# Altium project AINGF_V2.PrjPcb (part 1 of 2)
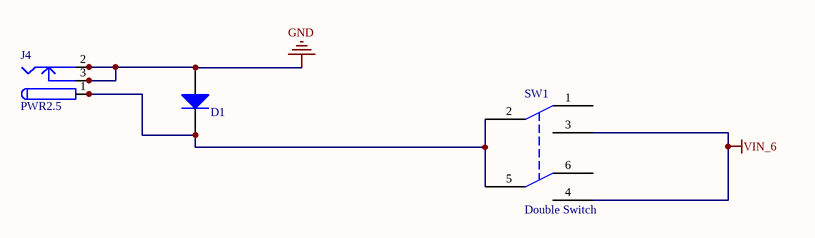
[diagram p0: PWR1.SchDoc]
15 sheets, 230 parts. Net scope: global (net labels, ports and power ports of the same name join across sheets).
Board file: PCB_T1.PcbDoc
Sheets:
  PWR1.SchDoc
  PWR2.SchDoc
  FPGA1.SchDoc
  FPGA2.SchDoc
  FPGA3.SchDoc
  FPGA4.SchDoc
  FPGA5.SchDoc
  FPGA6.SchDoc
  SRAM.SchDoc
  SRAM1.SchDoc
  USBFX2LP_1.SchDoc
  USBFX2LP_2.SchDoc
  USBFX2LP_3.SchDoc
  USBFX2LP_4.SchDoc
  FT2232D.SchDoc

## Sheet PWR1.SchDoc: Power1
size A; Revision: 04

### Parts
D1  SMD 4007 DIODE  [PCBComponent_1]  (value not drawn)
J4  PWR2.5  [KLD-0202]
SW1  Double Switch  [Switch - DPDT]

### Nets
GND: D1.1(A) J4.2 J4.2A J4.2B J4.3 J4.3A J4.3B
VIN_6: SW1.3 SW1.4
NetD1_2: D1.2(K) J4.1 J4.1A J4.1B SW1.2 SW1.5

Not connected (* = marked no-connect by the designer): SW1 1 6

### Notes on the sheet
- Engineer:
- Title:
- Saleh Jamali
- Revision:

### Library data of the parts
J4 = PWR2.5: Low Voltage Power Supply Connector; Published: 17-Dec-2003; DatasheetDocument: 09-May-2002; Publisher: Altium Limited; ComponentLink1Description: Manufacturer Link; ComponentLink1URL: http://domino.kycon.com/internet/Products.html
SW1 = Switch - DPDT: DPDT Switch

## Sheet PWR2.SchDoc: Power2
size A; Revision: 04
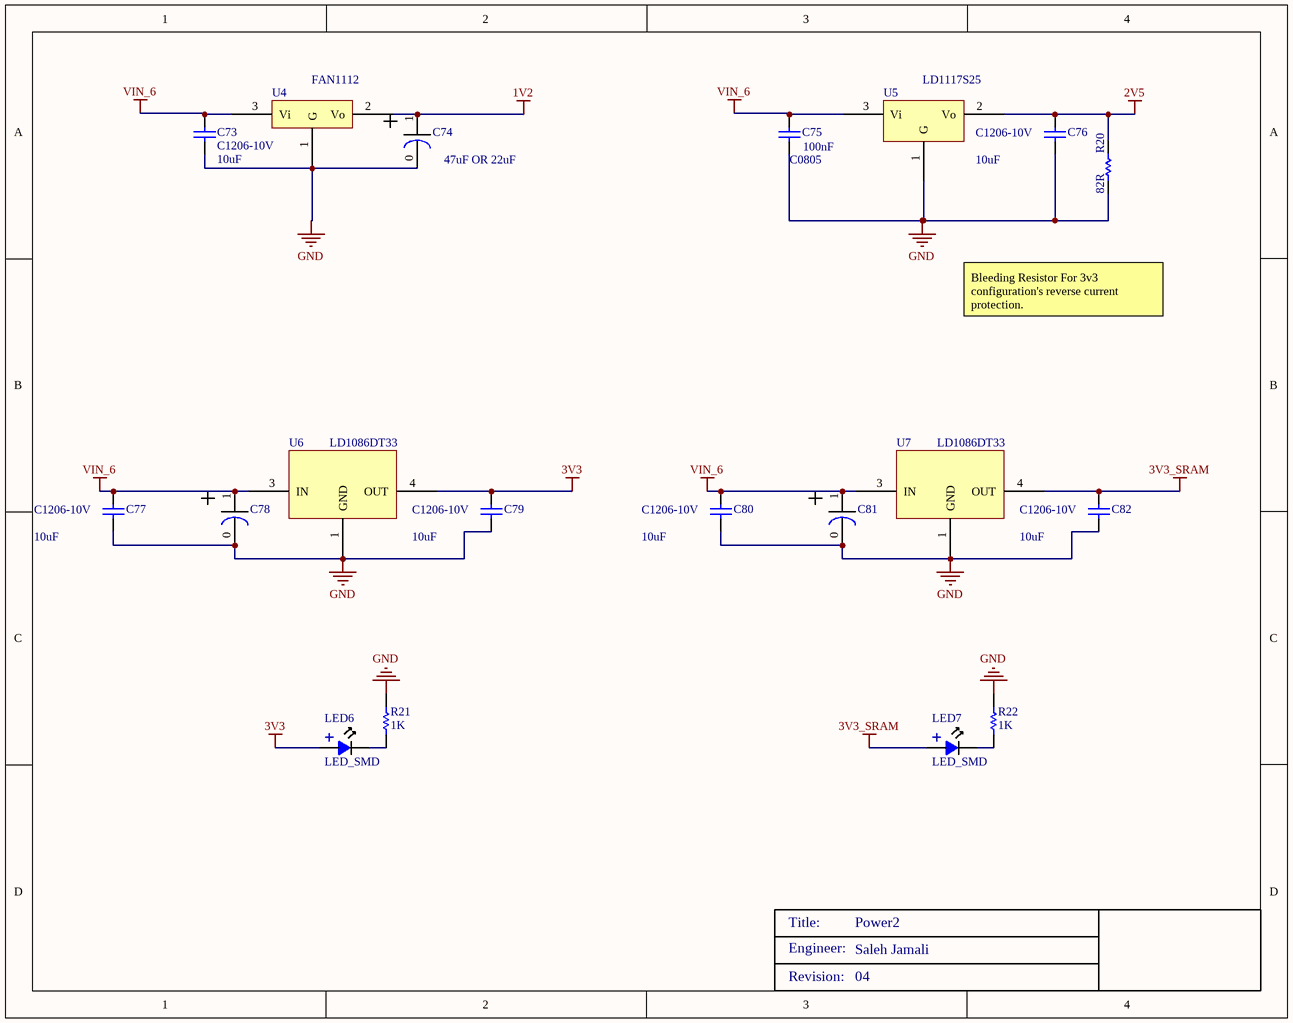
[diagram p1: PWR2.SchDoc]

### Parts
C73  C1206-10V  value 10uF  [1206]
C74  47uF OR 22uF  [22_47u_10A]
C75  C0805  value 100nF  [0805]
C76  C1206-10V  value 10uF  [1206]
C77  C1206-10V  value 10uF  [1206]
C78  Electrolytic SMD Cap  [22_47u_10A]  (value not drawn)
C79  C1206-10V  value 10uF  [1206]
C80  C1206-10V  value 10uF  [1206]
C81  Electrolytic SMD Cap  [22_47u_10A]  (value not drawn)
C82  C1206-10V  value 10uF  [1206]
LED6  LED_SMD  [LED_805]
LED7  LED_SMD  [LED_805]
R20  82R  [ERA-0805]
R21  1K  [ERA-0805]
R22  1K  [ERA-0805]
U4  FAN1112  [DPAK_TO252]
U5  LD1117S25  [SOT223]
U6  LD1086DT33  [LD1086DT33]
U7  LD1086DT33  [LD1086DT33]

### Nets
1V2: C74.1 U4.2(Vo)
2V5: C76.1 R20.2 U5.2(Vo)
3V3: C79.1 LED6.1 U6.4(OUT)
3V3_SRAM: C82.1 LED7.1 U7.4(OUT)
GND: C73.2 C74.0 C75.2 C76.2 C77.2 C78.0 C79.2 C80.2 C81.0 C82.2 R20.1 R21.1 R22.1 U4.1(G) U5.1(G) U6.1(GND) U7.1(GND)
VIN_6: C73.1 C75.1 C77.1 C78.1 C80.1 C81.1 U4.3(Vi) U5.3(Vi) U6.3(IN) U7.3(IN)
NetLED6_2: LED6.2 R21.2
NetLED7_2: LED7.2 R22.2

### Notes on the sheet
- Bleeding Resistor For 3v3 configuration's reverse current protection.
- Engineer:
- Title:
- Saleh Jamali
- Revision:

### Library data of the parts
C73 C76 C77 C79 C80 C82 = C1206: Ceramic Chip Capacitor - Standard; Published: 17-Jul-2002; LatestRevisionDate: 19-Mar-2004; LatestRevisionNote: Silkscreen size reduced.; DatasheetDocument: Mar-2001; PackageDocument: Mar-2001; PackageReference: 1206; Publisher: Altium Limited; Code_JEITA: 1206; Code_IPC: 3216 [1206]; ComponentLink1Description: Manufacturer Link; ComponentLink1URL: http://www.kemet.com/; ComponentLink2Description: Datasheet; ComponentLink2URL: http://www.kemet.com/kemet/web/homepage/kechome.nsf/vapubfilesname/F3102TA.pdf/$file/F3102TA.pdf
C74 = Electrolytic SMD Cap: supplier: eshop.eca.ir
C75 = C0805: Ceramic Chip Capacitor - Standard; Note: Footprint corresponds to dimensions for bulk cassette packaging. This case size has tightened tolerances.; Published: 17-Jul-2002; LatestRevisionDate: 19-Mar-2004; LatestRevisionNote: Silkscreen size reduced.; DatasheetDocument: Mar-2001; PackageDocument: Mar-2001; PackageReference: 0805; Publisher: Altium Limited; Code_JEITA: 0805; Code_IPC: 2012[0805]; ComponentLink1Description: Manufacturer Link; ComponentLink1URL: http://www.kemet.com/; ComponentLink2Description: Datasheet; ComponentLink2URL: http://www.kemet.com/kemet/web/homepage/kechome.nsf/vapubfilesname/F3102TA.pdf/$file/F3102TA.pdf
R20-R22 = ERA6Y: Rectangular Thick Film Chip Resistor, 10 Ohm to 1M Ohm Range, 0.1% and 0.5% Tolerance, 0805 Size, 0.1 W; Note: If flow soldering, adjust pad width of PCB Footprint to 0.7 - 0.8 times the width of the resistor.; Published: 17-Dec-2003; LatestRevisionDate: 19-Mar-2004; LatestRevisionNote: Silkscreen size reduced.; PackageDocument: Mar-2003; PackageReference: ERA-0805; Publisher: Altium Limited; Code_IPC: 2012 [0805]; ComponentLink1Description: Manufacturer Link; ComponentLink1URL: http://www.panasonic.com/industrial/components/resistive_products.htm; ComponentLink2Description: Datasheet; ComponentLink2URL: http://www.panasonic.com/industrial/components/pdf/AOA0000CE8.pdf
U4 = FAN1112_1.2V_REGULATER: 1.2 volt regulator
U5 = LD1117S25: 2.5 volt, 800mA Regulator
U6 U7 = LD1086DT33: LOW DROP FIXED AND ADJUSTABLE  POSITIVE VOLTAGE REGULATORS
C78 C81 = Electrolytic SMD Cap: supplier: eshop.eca.ir

## Sheet FPGA1.SchDoc: FPGA1
size A; Revision: 04
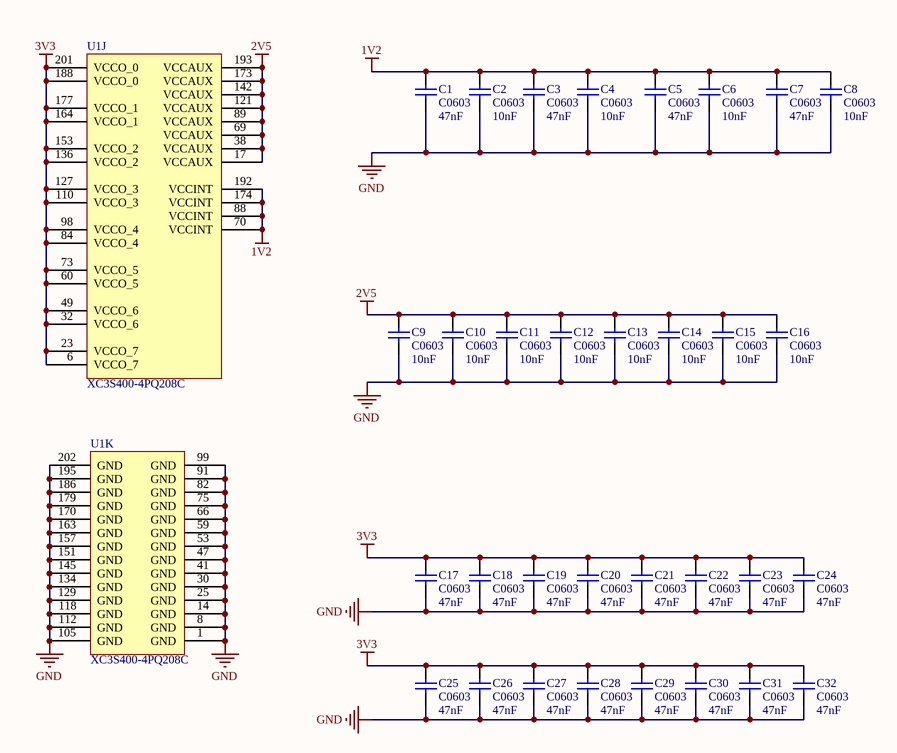
[diagram p2: FPGA1.SchDoc]

### Parts
C1  C0603  value 47nF  [0603]
C2  C0603  value 10nF  [0603]
C3  C0603  value 47nF  [0603]
C4  C0603  value 10nF  [0603]
C5  C0603  value 47nF  [0603]
C6  C0603  value 10nF  [0603]
C7  C0603  value 47nF  [0603]
C8  C0603  value 10nF  [0603]
C9  C0603  value 10nF  [0603]
C10  C0603  value 10nF  [0603]
C11  C0603  value 10nF  [0603]
C12  C0603  value 10nF  [0603]
C13  C0603  value 10nF  [0603]
C14  C0603  value 10nF  [0603]
C15  C0603  value 10nF  [0603]
C16  C0603  value 10nF  [0603]
C17  C0603  value 47nF  [0603]
C18  C0603  value 47nF  [0603]
C19  C0603  value 47nF  [0603]
C20  C0603  value 47nF  [0603]
C21  C0603  value 47nF  [0603]
C22  C0603  value 47nF  [0603]
C23  C0603  value 47nF  [0603]
C24  C0603  value 47nF  [0603]
C25  C0603  value 47nF  [0603]
C26  C0603  value 47nF  [0603]
C27  C0603  value 47nF  [0603]
C28  C0603  value 47nF  [0603]
C29  C0603  value 47nF  [0603]
C30  C0603  value 47nF  [0603]
C31  C0603  value 47nF  [0603]
C32  C0603  value 47nF  [0603]
U1  XC3S400-4PQ208C  [PQ208_N]  (parts J,K of 11)

### Nets
1V2: C1.2 C2.2 C3.2 C4.2 C5.2 C6.2 C7.2 C8.2 U1.70(VCCINT) U1.88(VCCINT) U1.174(VCCINT) U1.192(VCCINT)
2V5: C9.2 C10.2 C11.2 C12.2 C13.2 C14.2 C15.2 C16.2 U1.17(VCCAUX) U1.38(VCCAUX) U1.69(VCCAUX) U1.89(VCCAUX) U1.121(VCCAUX) U1.142(VCCAUX) U1.173(VCCAUX) U1.193(VCCAUX)
3V3: C17.2 C18.2 C19.2 C20.2 C21.2 C22.2 C23.2 C24.2 C25.2 C26.2 C27.2 C28.2 C29.2 C30.2 C31.2 C32.2 U1.6(VCCO_7) U1.23(VCCO_7) U1.32(VCCO_6) U1.49(VCCO_6) U1.60(VCCO_5) U1.73(VCCO_5) U1.84(VCCO_4) U1.98(VCCO_4) U1.110(VCCO_3) U1.127(VCCO_3) U1.136(VCCO_2) U1.153(VCCO_2) U1.164(VCCO_1) U1.177(VCCO_1) U1.188(VCCO_0) U1.201(VCCO_0)
GND: C1.1 C2.1 C3.1 C4.1 C5.1 C6.1 C7.1 C8.1 C9.1 C10.1 C11.1 C12.1 C13.1 C14.1 C15.1 C16.1 C17.1 C18.1 C19.1 C20.1 C21.1 C22.1 C23.1 C24.1 C25.1 C26.1 C27.1 C28.1 C29.1 C30.1 C31.1 C32.1 U1.1(GND) U1.8(GND) U1.14(GND) U1.25(GND) U1.30(GND) U1.41(GND) U1.47(GND) U1.53(GND) U1.59(GND) U1.66(GND) U1.75(GND) U1.82(GND) U1.91(GND) U1.99(GND) U1.105(GND) U1.112(GND) U1.118(GND) U1.129(GND) U1.134(GND) U1.145(GND) U1.151(GND) U1.157(GND) U1.163(GND) U1.170(GND) U1.179(GND) U1.186(GND) U1.195(GND) U1.202(GND)

### Notes on the sheet
- Engineer:
- Title:
- Saleh Jamali
- Revision:

### Library data of the parts
C1-C32 = C0603: Ceramic Chip Capacitor - Standard; Note: Footprint corresponds to dimensions for bulk cassette packaging. This case size has tightened tolerances.; Published: 17-Jul-2002; LatestRevisionDate: 19-Mar-2004; LatestRevisionNote: Silkscreen size reduced.; DatasheetDocument: Mar-2001; PackageDocument: Mar-2001; PackageReference: 0603; Publisher: Altium Limited; Code_JEITA: 0603; Code_IPC: 1608 [0603]; ComponentLink1Description: Manufacturer Link; ComponentLink1URL: http://www.kemet.com/; ComponentLink2Description: Datasheet; ComponentLink2URL: http://www.kemet.com/kemet/web/homepage/kechome.nsf/vapubfilesname/F3102TA.pdf/$file/F3102TA.pdf
U1 = XC3S400-4PQ208C: Spartan-3 1.2V FPGA, 141 User I/Os, 208-Pin PQFP, Standard Performance, Commercial Grade; OrderingInformation: Additional code may have to be appended for different mask revision devices.; DatasheetVersion: ver2.5, Dec-2009; PackageVersion: ver1.2, Jun-2004; PackageReference: PQ208; PackageDescription: 208-Pin Plastic Quad Flat Pack (PQ208); Code_JEDEC: MS-029-FA-1; ComponentLink1Description: Manufacturer URL; ComponentLink1URL: http://www.xilinx.com/; ComponentLink2Description: Spartan-3 Datasheet; ComponentLink2URL: http://www.xilinx.com/support/documentation/data_sheets/ds099.pdf; ComponentLink3Description: PQ208 Package Drawing; ComponentLink3URL: http://www.xilinx.com/support/documentation/package_specs/pq208.pdf; ComponentLink4Description: Spartan-3 Documents; ComponentLink4URL: http://www.xilinx.com/support/documentation/spartan-3.htm

## Sheet FPGA2.SchDoc: FPGA2
size A; Revision: 04
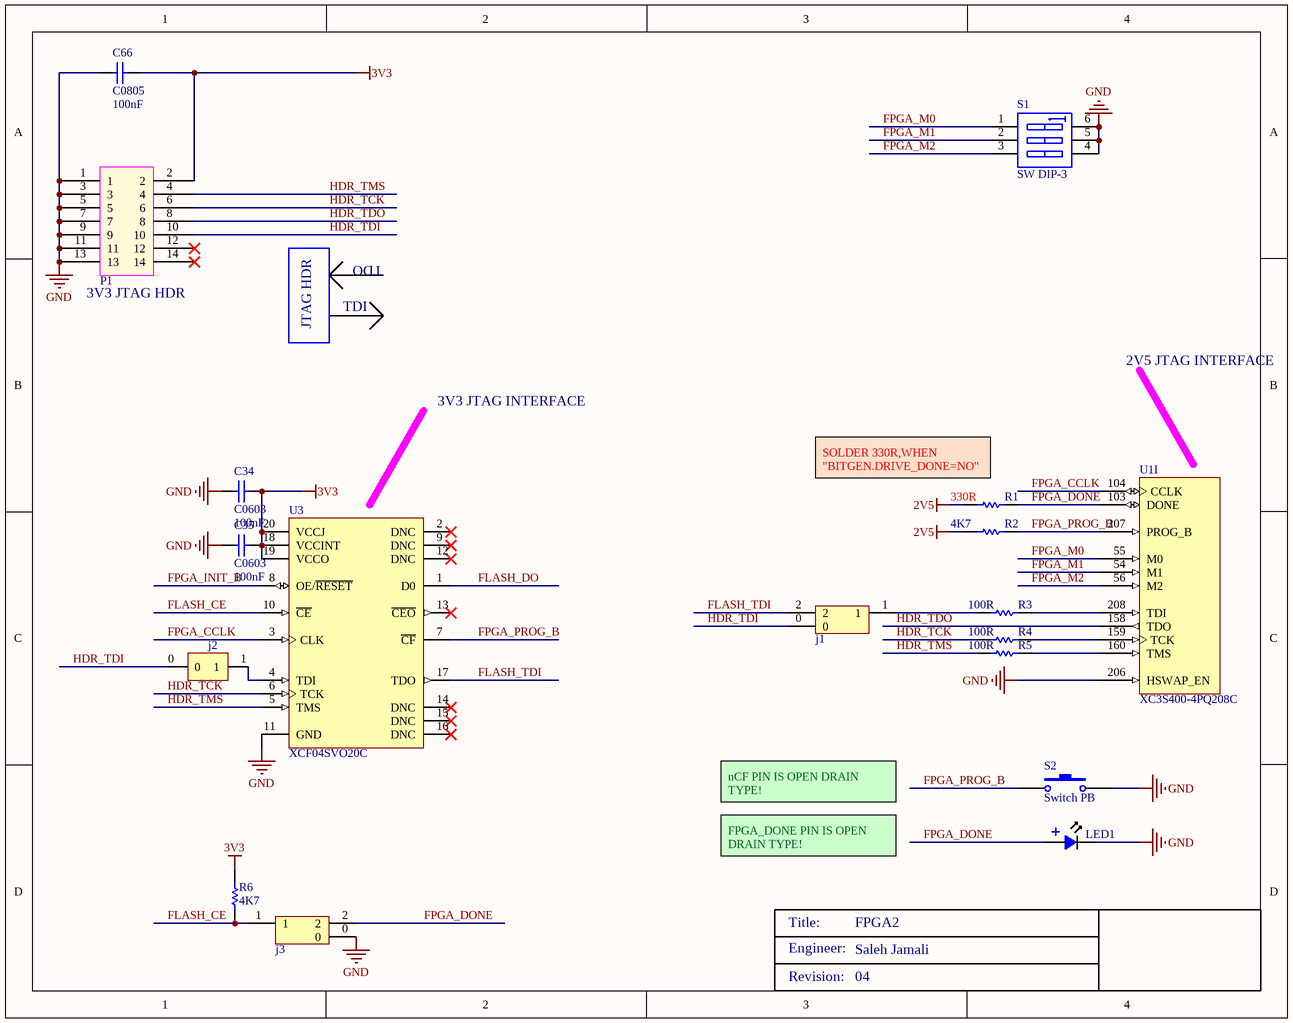
[diagram p3: FPGA2.SchDoc]

### Parts
C34  C0603  value 100nF  [0603]
C35  C0603  value 100nF  [0603]
C66  C0805  value 100nF  [0805]
j1  3pin  [3PIN]  (value not drawn)
j2  2pin  [2PIN]  (value not drawn)
j3  3pin  [3PIN]  (value not drawn)
LED1  LED_SMD  [LED_805]  (value not drawn)
P1  BoxHeader_14  [14p]  (value not drawn)
R1  330R  [ERA-0805]
R2  4K7  [ERA-0805]
R3  100R  [ERA-0805]
R4  100R  [ERA-0805]
R5  100R  [ERA-0805]
R6  4K7  [ERA-0805]
S1  SW DIP-3  [DIP-6]
S2  Switch PB  [Switch - Push to On]
U1  XC3S400-4PQ208C  [PQ208_N]  (part I of 11)
U3  XCF04SVO20C  [VO20_N]

### Nets
2V5: R1.1 R2.1
3V3: C34.1 C35.1 C66.2 P1.2 R6.2 U3.18(VCCINT) U3.19(VCCO) U3.20(VCCJ)
GND: C34.2 C35.2 C66.1 j3.0 LED1.2 P1.1 P1.3 P1.5 P1.7 P1.9 P1.11 P1.13 S1.4(B3) S1.5(B2) S1.6(B1) S2.2 U1.206(HSWAP_EN) U3.11(GND)
FLASH_CE: j3.1 R6.1 U3.10(~{CE})
FLASH_DO: U3.1(D0)
FLASH_TDI: j1.2 U3.17(TDO)
FPGA_CCLK: U1.104(CCLK) U3.3(CLK)
FPGA_DONE: j3.2 LED1.1 R1.2 U1.103(DONE)
FPGA_INIT_B: U3.8(OE/~{RESET})
FPGA_M0: S1.1(A1) U1.55(M0)
FPGA_M1: S1.2(A2) U1.54(M1)
FPGA_M2: S1.3(A3) U1.56(M2)
FPGA_PROG_B: R2.2 S2.1 U1.207(PROG_B) U3.7(~{CF})
HDR_TCK: P1.6 R4.1 U3.6(TCK)
HDR_TDI: j1.0 j2.0 P1.10
HDR_TDO: P1.8 U1.158(TDO)
HDR_TMS: P1.4 R5.1 U3.5(TMS)
Netj1_1: j1.1 R3.1
Netj2_1: j2.1 U3.4(TDI)
NetR3_2: R3.2 U1.208(TDI)
NetR4_2: R4.2 U1.159(TCK)
NetR5_2: R5.2 U1.160(TMS)

Not connected (* = marked no-connect by the designer): P1 12* 14*; U3 2(DNC)* 9(DNC)* 12(DNC)* 13(~{CEO})* 14(DNC)* 15(DNC)* 16(DNC)*

### Notes on the sheet
- (near P1) 3V3 JTAG HDR
- TDO
- JTAG HDR
- TDI
- 2V5 JTAG INTERFACE
- 3V3 JTAG INTERFACE
- (near R1) SOLDER 330R,WHEN "BITGEN.DRIVE_DONE=NO"
- (near U1) if HSWAP=GND then
  {
  pullup resistors Enabled
  }
- nCF PIN IS OPEN DRAIN TYPE!
- FPGA_DONE PIN IS OPEN DRAIN TYPE!
- Engineer:
- Title:
- Saleh Jamali
- Revision:

### Library data of the parts
C34 C35 = C0603: as C1 on sheet FPGA1; Published: 17-Jul-2002; LatestRevisionDate: 19-Mar-2004; LatestRevisionNote: Silkscreen size reduced.; DatasheetDocument: Mar-2001; PackageDocument: Mar-2001; PackageReference: 0603; Publisher: Altium Limited; Code_JEITA: 0603; Code_IPC: 1608 [0603]; ComponentLink1Description: Manufacturer Link; ComponentLink1URL: http://www.kemet.com/; ComponentLink2Description: Datasheet; ComponentLink2URL: http://www.kemet.com/kemet/web/homepage/kechome.nsf/vapubfilesname/F3102TA.pdf/$file/F3102TA.pdf
C66 = C0805: as C75 on sheet PWR2; Published: 17-Jul-2002; LatestRevisionDate: 19-Mar-2004; LatestRevisionNote: Silkscreen size reduced.; DatasheetDocument: Mar-2001; PackageDocument: Mar-2001; PackageReference: 0805; Publisher: Altium Limited; Code_JEITA: 0805; Code_IPC: 2012[0805]; ComponentLink1Description: Manufacturer Link; ComponentLink1URL: http://www.kemet.com/; ComponentLink2Description: Datasheet; ComponentLink2URL: http://www.kemet.com/kemet/web/homepage/kechome.nsf/vapubfilesname/F3102TA.pdf/$file/F3102TA.pdf
R1-R6 = ERA6Y: as R20 on sheet PWR2; Published: 17-Dec-2003; LatestRevisionDate: 19-Mar-2004; LatestRevisionNote: Silkscreen size reduced.; PackageDocument: Mar-2003; PackageReference: ERA-0805; Publisher: Altium Limited; Code_IPC: 2012 [0805]; ComponentLink1Description: Manufacturer Link; ComponentLink1URL: http://www.panasonic.com/industrial/components/resistive_products.htm; ComponentLink2Description: Datasheet; ComponentLink2URL: http://www.panasonic.com/industrial/components/pdf/AOA0000CE8.pdf
S1 = SW DIP-3: DIP Switch, 3 Position, SPST; Published: 24-Mar-1999; LatestRevisionDate: 17-Jul-2002; LatestRevisionNote: Re-released for DXP Platform.; PackageReference: DIP-6; Publisher: Altium Limited; Code_JEDEC: MO-001-AM
S2 = Switch PB: Push Button Switch
U1 = XC3S400-4PQ208C: as U1 on sheet FPGA1; DatasheetVersion: ver2.5, Dec-2009; PackageVersion: ver1.2, Jun-2004; PackageReference: PQ208; PackageDescription: 208-Pin Plastic Quad Flat Pack (PQ208); Code_JEDEC: MS-029-FA-1; ComponentLink1Description: Manufacturer URL; ComponentLink1URL: http://www.xilinx.com/; ComponentLink2Description: Spartan-3 Datasheet; ComponentLink2URL: http://www.xilinx.com/support/documentation/data_sheets/ds099.pdf; ComponentLink3Description: PQ208 Package Drawing; ComponentLink3URL: http://www.xilinx.com/support/documentation/package_specs/pq208.pdf; ComponentLink4Description: Spartan-3 Documents; ComponentLink4URL: http://www.xilinx.com/support/documentation/spartan-3.htm
U3 = XCF04SVO20C: XCF00S Series, Platform Flash In-System Programmable Configuration 3.3V PROM, 20-Pin TSOP, 4-Megabit, Commercial Grade; DatasheetVersion: ver2.17, Oct-2009; PackageVersion: ver1.3, Dec-2008; PackageReference: VO20; PackageDescription: 20-Pin Thin Shrink Small Outline Package (VO20); Code_JEDEC: MO-153-AC; ComponentLink1Description: Manufacturer URL; ComponentLink1URL: http://www.xilinx.com/; ComponentLink2Description: Platform Flash Datasheet; ComponentLink2URL: http://www.xilinx.com/support/documentation/data_sheets/ds123.pdf; ComponentLink3Description: VO20 Package Drawing; ComponentLink3URL: http://www.xilinx.com/support/documentation/package_specs/vo20.pdf; ComponentLink4Description: Configuration PROM Documents; ComponentLink4URL: http://www.xilinx.com/support/documentation/configuration_proms.htm

## Sheet FPGA3.SchDoc: FPGA-3
size A; Revision: 05
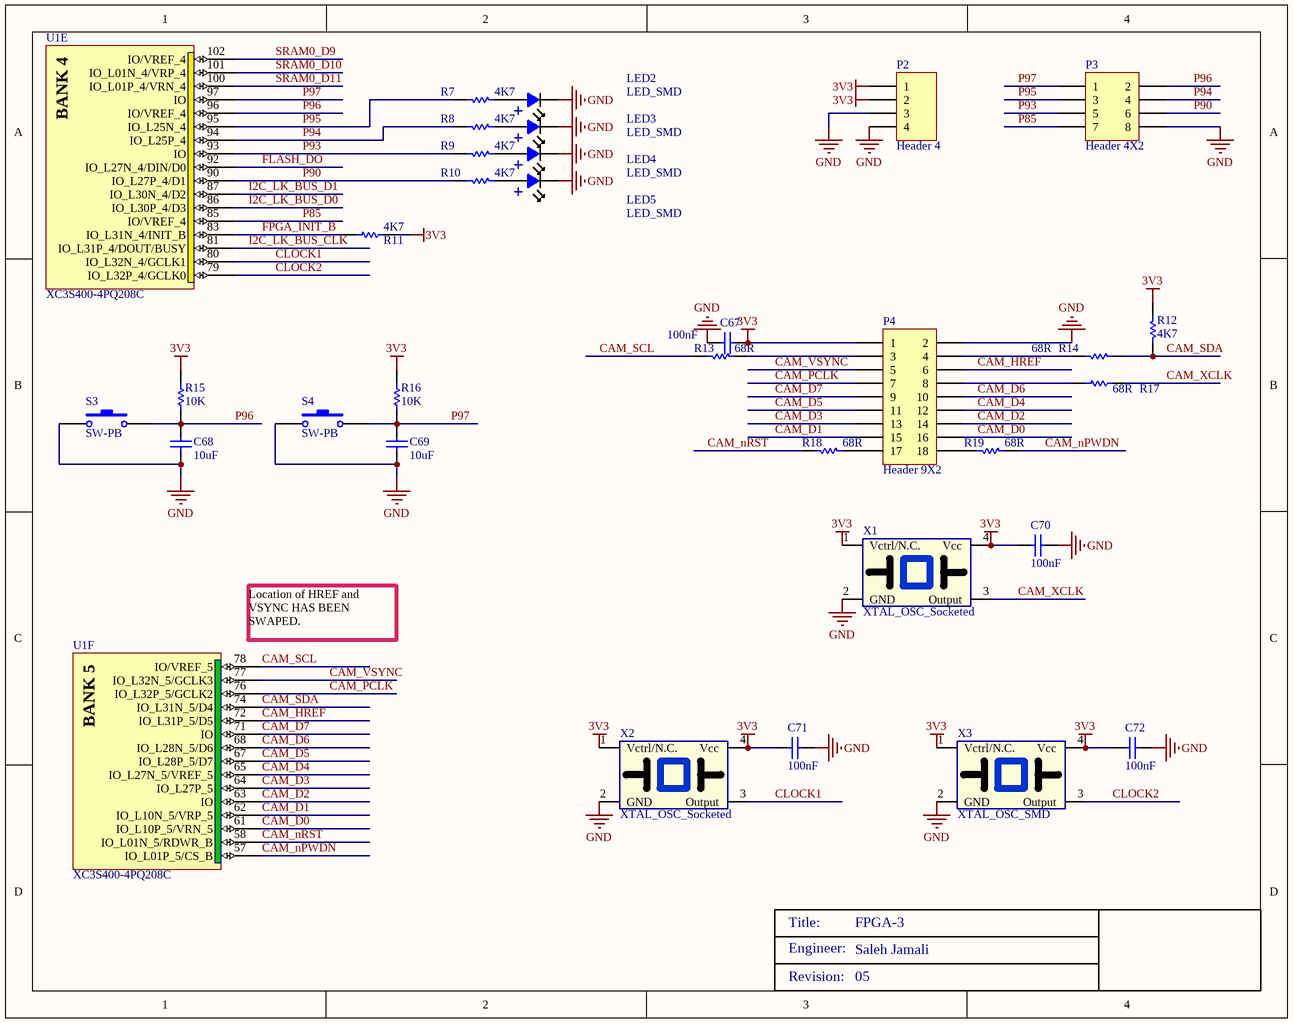
[diagram p4: FPGA3.SchDoc]

### Parts
C67  value 100nF  [0805]  (hidden comment: C0805)
C68  value 10uF  [0805]  (hidden comment: C0805)
C69  value 10uF  [0805]  (hidden comment: C0805)
C70  value 100nF  [0805]  (hidden comment: C0805)
C71  value 100nF  [0805]  (hidden comment: C0805)
C72  value 100nF  [0805]  (hidden comment: C0805)
LED2  LED_SMD  [LED_805]
LED3  LED_SMD  [LED_805]
LED4  LED_SMD  [LED_805]
LED5  LED_SMD  [LED_805]
P2  Header 4  [HDR1X4]
P3  Header 4X2  [HDR2X4]
P4  Header 9X2  [HDR2X9]
R7  4K7  [ERA-0805]
R8  4K7  [ERA-0805]
R9  4K7  [ERA-0805]
R10  4K7  [ERA-0805]
R11  4K7  [ERA-0805]
R12  4K7  [ERA-0805]
R13  68R  [ERA-0805]
R14  68R  [ERA-0805]
R15  10K  [ERA-0805]
R16  10K  [ERA-0805]
R17  68R  [ERA-0805]
R18  68R  [ERA-0805]
R19  68R  [ERA-0805]
S3  SW-PB  [SPST-2]
S4  SW-PB  [SPST-2]
U1  XC3S400-4PQ208C  [PQ208_N]  (parts E,F of 11)
X1  XTAL_OSC_Socketed  [CRYSTAL_OSC]
X2  XTAL_OSC_Socketed  [CRYSTAL_OSC]
X3  XTAL_OSC_SMD  [5x7mm SMD]

### Nets
3V3: C67.2 C70.1 C71.1 C72.1 P2.1 P2.2 P4.1 R11.1 R12.1 R15.1 R16.1 X1.1(Vctrl/N.C.) X1.4(Vcc) X2.1(Vctrl/N.C.) X2.4(Vcc) X3.1(Vctrl/N.C.) X3.4(Vcc)
GND: C67.1 C68.1 C69.1 C70.2 C71.2 C72.2 LED2.2 LED3.2 LED4.2 LED5.2 P2.3 P2.4 P3.8 P4.2 S3.1 S4.1 X1.2(GND) X2.2(GND) X3.2(GND)
CAM_D0: P4.16 U1.61(IO_L10P_5/VRN_5)
CAM_D1: P4.15 U1.62(IO_L10N_5/VRP_5)
CAM_D2: P4.14 U1.63(IO)
CAM_D3: P4.13 U1.64(IO_L27P_5)
CAM_D4: P4.12 U1.65(IO_L27N_5/VREF_5)
CAM_D5: P4.11 U1.67(IO_L28P_5/D7)
CAM_D6: P4.10 U1.68(IO_L28N_5/D6)
CAM_D7: P4.9 U1.71(IO)
CAM_HREF: P4.6 U1.72(IO_L31P_5/D5)
CAM_nPWDN: R19.2 U1.57(IO_L01P_5/CS_B)
CAM_nRST: R18.1 U1.58(IO_L01N_5/RDWR_B)
CAM_PCLK: P4.7 U1.76(IO_L32P_5/GCLK2)
CAM_SCL: R13.1 U1.78(IO/VREF_5)
CAM_SDA: R12.2 R14.1 U1.74(IO_L31N_5/D4)
CAM_VSYNC: P4.5 U1.77(IO_L32N_5/GCLK3)
CAM_XCLK: R17.1 X1.3(Output)
CLOCK1: U1.80(IO_L32N_4/GCLK1) X2.3(Output)
CLOCK2: U1.79(IO_L32P_4/GCLK0) X3.3(Output)
FLASH_DO: U1.92(IO_L27N_4/DIN/D0)
FPGA_INIT_B: R11.2 U1.83(IO_L31N_4/INIT_B)
I2C_LK_BUS_CLK: U1.81(IO_L31P_4/DOUT/BUSY)
I2C_LK_BUS_D0: U1.86(IO_L30P_4/D3)
I2C_LK_BUS_D1: U1.87(IO_L30N_4/D2)
P85: P3.7 U1.85(IO/VREF_4)
P90: P3.6 R10.1 U1.90(IO_L27P_4/D1)
P93: P3.5 R9.1 U1.93(IO)
P94: P3.4 R8.1 U1.94(IO_L25P_4)
P95: P3.3 R7.1 U1.95(IO_L25N_4)
P96: C68.2 P3.2 R15.2 S3.2 U1.96(IO/VREF_4)
P97: C69.2 P3.1 R16.2 S4.2 U1.97(IO)
SRAM0_D9: U1.102(IO/VREF_4)
SRAM0_D10: U1.101(IO_L01N_4/VRP_4)
SRAM0_D11: U1.100(IO_L01P_4/VRN_4)
NetLED2_1: LED2.1 R7.2
NetLED3_1: LED3.1 R8.2
NetLED4_1: LED4.1 R9.2
NetLED5_1: LED5.1 R10.2
NetP4_3: P4.3 R13.2
NetP4_4: P4.4 R14.2
NetP4_8: P4.8 R17.2
NetP4_17: P4.17 R18.2
NetP4_18: P4.18 R19.1

### Notes on the sheet
- (near U1) Location of HREF and VSYNC HAS BEEN SWAPED.
- Engineer:
- Title:
- Saleh Jamali
- Revision:
- (in symbol XC3S400-4PQ208C, part E) BANK 4
- (in symbol XC3S400-4PQ208C, part F) BANK 5

### Library data of the parts
C67-C72 = C0805: as C75 on sheet PWR2; Published: 17-Jul-2002; LatestRevisionDate: 19-Mar-2004; LatestRevisionNote: Silkscreen size reduced.; DatasheetDocument: Mar-2001; PackageDocument: Mar-2001; PackageReference: 0805; Publisher: Altium Limited; Code_JEITA: 0805; Code_IPC: 2012[0805]; ComponentLink1Description: Manufacturer Link; ComponentLink1URL: http://www.kemet.com/; ComponentLink2Description: Datasheet; ComponentLink2URL: http://www.kemet.com/kemet/web/homepage/kechome.nsf/vapubfilesname/F3102TA.pdf/$file/F3102TA.pdf
P2 = Header 4: Header, 4-Pin; LatestRevisionDate: 17-Jul-2002; LatestRevisionNote: Re-released for DXP Platform.; Publisher: Altium Limited
P3 = Header 4X2: Header, 4-Pin, Dual row; LatestRevisionDate: 17-Jul-2002; LatestRevisionNote: Re-released for DXP Platform.; Publisher: Altium Limited
P4 = Header 9X2: Header, 9-Pin, Dual row; LatestRevisionDate: 17-Jul-2002; LatestRevisionNote: Re-released for DXP Platform.; Publisher: Altium Limited
R7-R19 = ERA6Y: as R20 on sheet PWR2; Published: 17-Dec-2003; LatestRevisionDate: 19-Mar-2004; LatestRevisionNote: Silkscreen size reduced.; PackageDocument: Mar-2003; PackageReference: ERA-0805; Publisher: Altium Limited; Code_IPC: 2012 [0805]; ComponentLink1Description: Manufacturer Link; ComponentLink1URL: http://www.panasonic.com/industrial/components/resistive_products.htm; ComponentLink2Description: Datasheet; ComponentLink2URL: http://www.panasonic.com/industrial/components/pdf/AOA0000CE8.pdf
S3 S4 = SW-PB: Switch; Published: 24-Mar-1999; LatestRevisionDate: 17-Jul-2002; LatestRevisionNote: Re-released for DXP Platform.; PackageReference: SPST-2; Publisher: Altium Limited; PackageDescription: Switch; 2 Leads
U1 = XC3S400-4PQ208C: as U1 on sheet FPGA1; DatasheetVersion: ver2.5, Dec-2009; PackageVersion: ver1.2, Jun-2004; PackageReference: PQ208; PackageDescription: 208-Pin Plastic Quad Flat Pack (PQ208); Code_JEDEC: MS-029-FA-1; ComponentLink1Description: Manufacturer URL; ComponentLink1URL: http://www.xilinx.com/; ComponentLink2Description: Spartan-3 Datasheet; ComponentLink2URL: http://www.xilinx.com/support/documentation/data_sheets/ds099.pdf; ComponentLink3Description: PQ208 Package Drawing; ComponentLink3URL: http://www.xilinx.com/support/documentation/package_specs/pq208.pdf; ComponentLink4Description: Spartan-3 Documents; ComponentLink4URL: http://www.xilinx.com/support/documentation/spartan-3.htm
X1-X3 = Crystal Oscillator

## Sheet FPGA4.SchDoc: FPGA-4
size A; Revision: 04
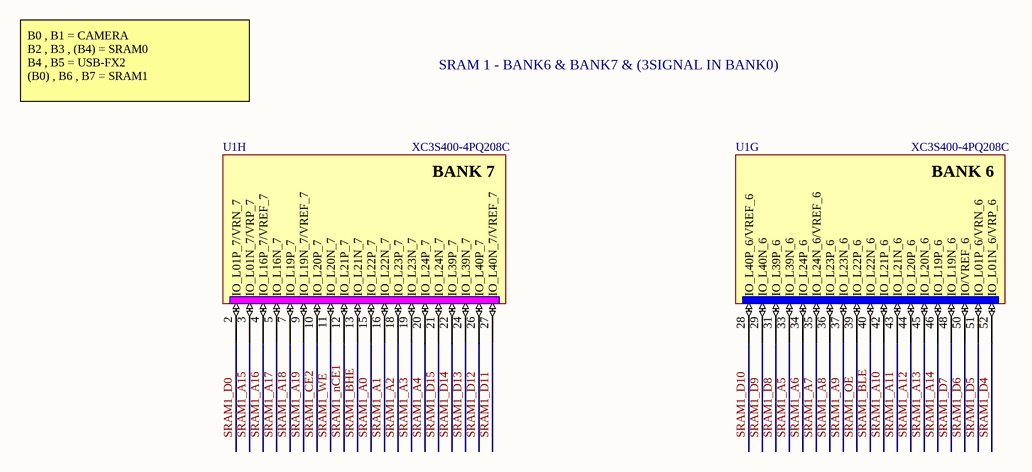
[diagram p5: FPGA4.SchDoc]

### Parts
U1  XC3S400-4PQ208C  [PQ208_N]  (parts G,H of 11)

### Nets
SRAM1_A0: U1.15(IO_L22P_7)
SRAM1_A1: U1.16(IO_L22N_7)
SRAM1_A2: U1.18(IO_L23P_7)
SRAM1_A3: U1.19(IO_L23N_7)
SRAM1_A4: U1.20(IO_L24P_7)
SRAM1_A5: U1.33(IO_L39N_6)
SRAM1_A6: U1.34(IO_L24P_6)
SRAM1_A7: U1.35(IO_L24N_6/VREF_6)
SRAM1_A8: U1.36(IO_L23P_6)
SRAM1_A9: U1.37(IO_L23N_6)
SRAM1_A10: U1.42(IO_L21P_6)
SRAM1_A11: U1.43(IO_L21N_6)
SRAM1_A12: U1.44(IO_L20P_6)
SRAM1_A13: U1.45(IO_L20N_6)
SRAM1_A14: U1.46(IO_L19P_6)
SRAM1_A15: U1.3(IO_L01N_7/VRP_7)
SRAM1_A16: U1.4(IO_L16P_7/VREF_7)
SRAM1_A17: U1.5(IO_L16N_7)
SRAM1_A18: U1.7(IO_L19P_7)
SRAM1_A19: U1.9(IO_L19N_7/VREF_7)
SRAM1_BHE: U1.13(IO_L21N_7)
SRAM1_BLE: U1.40(IO_L22N_6)
SRAM1_CE2: U1.10(IO_L20P_7)
SRAM1_D0: U1.2(IO_L01P_7/VRN_7)
SRAM1_D4: U1.52(IO_L01N_6/VRP_6)
SRAM1_D5: U1.51(IO_L01P_6/VRN_6)
SRAM1_D6: U1.50(IO/VREF_6)
SRAM1_D7: U1.48(IO_L19N_6)
SRAM1_D8: U1.31(IO_L39P_6)
SRAM1_D9: U1.29(IO_L40N_6)
SRAM1_D10: U1.28(IO_L40P_6/VREF_6)
SRAM1_D11: U1.27(IO_L40N_7/VREF_7)
SRAM1_D12: U1.26(IO_L40P_7)
SRAM1_D13: U1.24(IO_L39N_7)
SRAM1_D14: U1.22(IO_L39P_7)
SRAM1_D15: U1.21(IO_L24N_7)
SRAM1_nCE1: U1.12(IO_L21P_7)
SRAM1_OE: U1.39(IO_L22P_6)
SRAM1_WE: U1.11(IO_L20N_7)

### Notes on the sheet
- SRAM 1 - BANK6 & BANK7 & (3SIGNAL IN BANK0)
- B0 , B1 = CAMERA
  B2 , B3 , (B4) = SRAM0
  B4 , B5 = USB-FX2
  (B0) , B6 , B7 = SRAM1
- Engineer:
- Title:
- Saleh Jamali
- Revision:
- (in symbol XC3S400-4PQ208C, part G) BANK 6
- (in symbol XC3S400-4PQ208C, part H) BANK 7

### Library data of the parts
U1 = XC3S400-4PQ208C: as U1 on sheet FPGA1; DatasheetVersion: ver2.5, Dec-2009; PackageVersion: ver1.2, Jun-2004; PackageReference: PQ208; PackageDescription: 208-Pin Plastic Quad Flat Pack (PQ208); Code_JEDEC: MS-029-FA-1; ComponentLink1Description: Manufacturer URL; ComponentLink1URL: http://www.xilinx.com/; ComponentLink2Description: Spartan-3 Datasheet; ComponentLink2URL: http://www.xilinx.com/support/documentation/data_sheets/ds099.pdf; ComponentLink3Description: PQ208 Package Drawing; ComponentLink3URL: http://www.xilinx.com/support/documentation/package_specs/pq208.pdf; ComponentLink4Description: Spartan-3 Documents; ComponentLink4URL: http://www.xilinx.com/support/documentation/spartan-3.htm

## Sheet FPGA5.SchDoc: FPGA-5
size A; Revision: 04
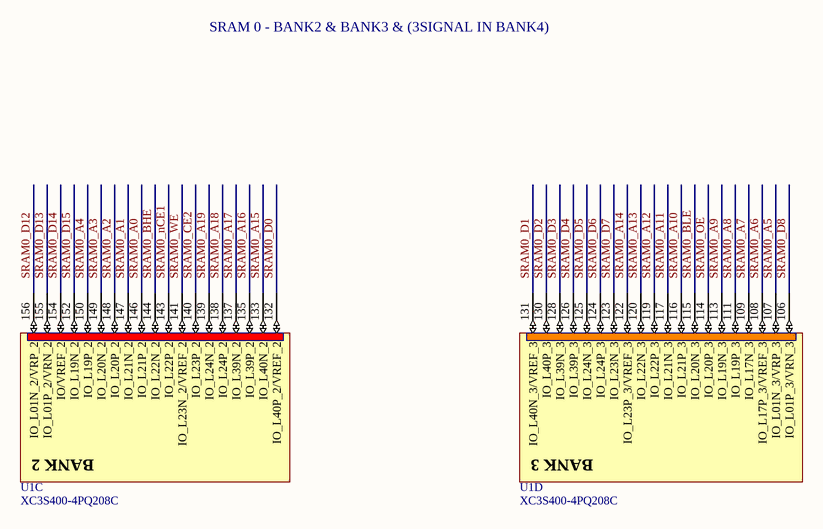
[diagram p6: FPGA5.SchDoc]

### Parts
U1  XC3S400-4PQ208C  [PQ208_N]  (parts C,D of 11)

### Nets
SRAM0_A0: U1.146(IO_L21P_2)
SRAM0_A1: U1.147(IO_L21N_2)
SRAM0_A2: U1.148(IO_L20P_2)
SRAM0_A3: U1.149(IO_L20N_2)
SRAM0_A4: U1.150(IO_L19P_2)
SRAM0_A5: U1.107(IO_L01N_3/VRP_3)
SRAM0_A6: U1.108(IO_L17P_3/VREF_3)
SRAM0_A7: U1.109(IO_L17N_3)
SRAM0_A8: U1.111(IO_L19P_3)
SRAM0_A9: U1.113(IO_L19N_3)
SRAM0_A10: U1.116(IO_L21P_3)
SRAM0_A11: U1.117(IO_L21N_3)
SRAM0_A12: U1.119(IO_L22P_3)
SRAM0_A13: U1.120(IO_L22N_3)
SRAM0_A14: U1.122(IO_L23P_3/VREF_3)
SRAM0_A15: U1.133(IO_L40N_2)
SRAM0_A16: U1.135(IO_L39P_2)
SRAM0_A17: U1.137(IO_L39N_2)
SRAM0_A18: U1.138(IO_L24P_2)
SRAM0_A19: U1.139(IO_L24N_2)
SRAM0_BHE: U1.144(IO_L22N_2)
SRAM0_BLE: U1.115(IO_L20N_3)
SRAM0_CE2: U1.140(IO_L23P_2)
SRAM0_D0: U1.132(IO_L40P_2/VREF_2)
SRAM0_D1: U1.131(IO_L40N_3/VREF_3)
SRAM0_D2: U1.130(IO_L40P_3)
SRAM0_D3: U1.128(IO_L39N_3)
SRAM0_D4: U1.126(IO_L39P_3)
SRAM0_D5: U1.125(IO_L24N_3)
SRAM0_D6: U1.124(IO_L24P_3)
SRAM0_D7: U1.123(IO_L23N_3)
SRAM0_D8: U1.106(IO_L01P_3/VRN_3)
SRAM0_D12: U1.156(IO_L01N_2/VRP_2)
SRAM0_D13: U1.155(IO_L01P_2/VRN_2)
SRAM0_D14: U1.154(IO/VREF_2)
SRAM0_D15: U1.152(IO_L19N_2)
SRAM0_nCE1: U1.143(IO_L22P_2)
SRAM0_OE: U1.114(IO_L20P_3)
SRAM0_WE: U1.141(IO_L23N_2/VREF_2)

### Notes on the sheet
- SRAM 0 - BANK2 & BANK3 & (3SIGNAL IN BANK4)
- Engineer:
- Title:
- Saleh Jamali
- Revision:
- (in symbol XC3S400-4PQ208C, part C) BANK 2
- (in symbol XC3S400-4PQ208C, part D) BANK 3

### Library data of the parts
U1 = XC3S400-4PQ208C: as U1 on sheet FPGA1; DatasheetVersion: ver2.5, Dec-2009; PackageVersion: ver1.2, Jun-2004; PackageReference: PQ208; PackageDescription: 208-Pin Plastic Quad Flat Pack (PQ208); Code_JEDEC: MS-029-FA-1; ComponentLink1Description: Manufacturer URL; ComponentLink1URL: http://www.xilinx.com/; ComponentLink2Description: Spartan-3 Datasheet; ComponentLink2URL: http://www.xilinx.com/support/documentation/data_sheets/ds099.pdf; ComponentLink3Description: PQ208 Package Drawing; ComponentLink3URL: http://www.xilinx.com/support/documentation/package_specs/pq208.pdf; ComponentLink4Description: Spartan-3 Documents; ComponentLink4URL: http://www.xilinx.com/support/documentation/spartan-3.htm

## Sheet FPGA6.SchDoc: FPGA-6
size A; Revision: 04
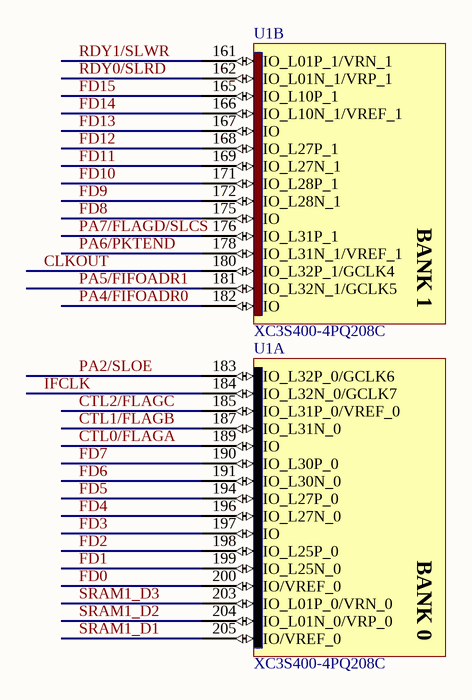
[diagram p7: FPGA6.SchDoc]

### Parts
U1  XC3S400-4PQ208C  [PQ208_N]  (parts A,B of 11)

### Nets
CLKOUT: U1.180(IO_L32P_1/GCLK4)
CTL0/FLAGA: U1.189(IO)
CTL1/FLAGB: U1.187(IO_L31N_0)
CTL2/FLAGC: U1.185(IO_L31P_0/VREF_0)
FD0: U1.200(IO/VREF_0)
FD1: U1.199(IO_L25N_0)
FD2: U1.198(IO_L25P_0)
FD3: U1.197(IO)
FD4: U1.196(IO_L27N_0)
FD5: U1.194(IO_L27P_0)
FD6: U1.191(IO_L30N_0)
FD7: U1.190(IO_L30P_0)
FD8: U1.175(IO)
FD9: U1.172(IO_L28N_1)
FD10: U1.171(IO_L28P_1)
FD11: U1.169(IO_L27N_1)
FD12: U1.168(IO_L27P_1)
FD13: U1.167(IO)
FD14: U1.166(IO_L10N_1/VREF_1)
FD15: U1.165(IO_L10P_1)
IFCLK: U1.184(IO_L32N_0/GCLK7)
PA2/SLOE: U1.183(IO_L32P_0/GCLK6)
PA4/FIFOADR0: U1.182(IO)
PA5/FIFOADR1: U1.181(IO_L32N_1/GCLK5)
PA6/PKTEND: U1.178(IO_L31N_1/VREF_1)
PA7/FLAGD/SLCS: U1.176(IO_L31P_1)
RDY0/SLRD: U1.162(IO_L01N_1/VRP_1)
RDY1/SLWR: U1.161(IO_L01P_1/VRN_1)
SRAM1_D1: U1.205(IO/VREF_0)
SRAM1_D2: U1.204(IO_L01N_0/VRP_0)
SRAM1_D3: U1.203(IO_L01P_0/VRN_0)

### Notes on the sheet
- Engineer:
- Title:
- Saleh Jamali
- Revision:
- (in symbol XC3S400-4PQ208C, part A) BANK 0
- (in symbol XC3S400-4PQ208C, part B) BANK 1

### Library data of the parts
U1 = XC3S400-4PQ208C: as U1 on sheet FPGA1; DatasheetVersion: ver2.5, Dec-2009; PackageVersion: ver1.2, Jun-2004; PackageReference: PQ208; PackageDescription: 208-Pin Plastic Quad Flat Pack (PQ208); Code_JEDEC: MS-029-FA-1; ComponentLink1Description: Manufacturer URL; ComponentLink1URL: http://www.xilinx.com/; ComponentLink2Description: Spartan-3 Datasheet; ComponentLink2URL: http://www.xilinx.com/support/documentation/data_sheets/ds099.pdf; ComponentLink3Description: PQ208 Package Drawing; ComponentLink3URL: http://www.xilinx.com/support/documentation/package_specs/pq208.pdf; ComponentLink4Description: Spartan-3 Documents; ComponentLink4URL: http://www.xilinx.com/support/documentation/spartan-3.htm

## Sheet SRAM.SchDoc: SRAM0
size A; Revision: 04
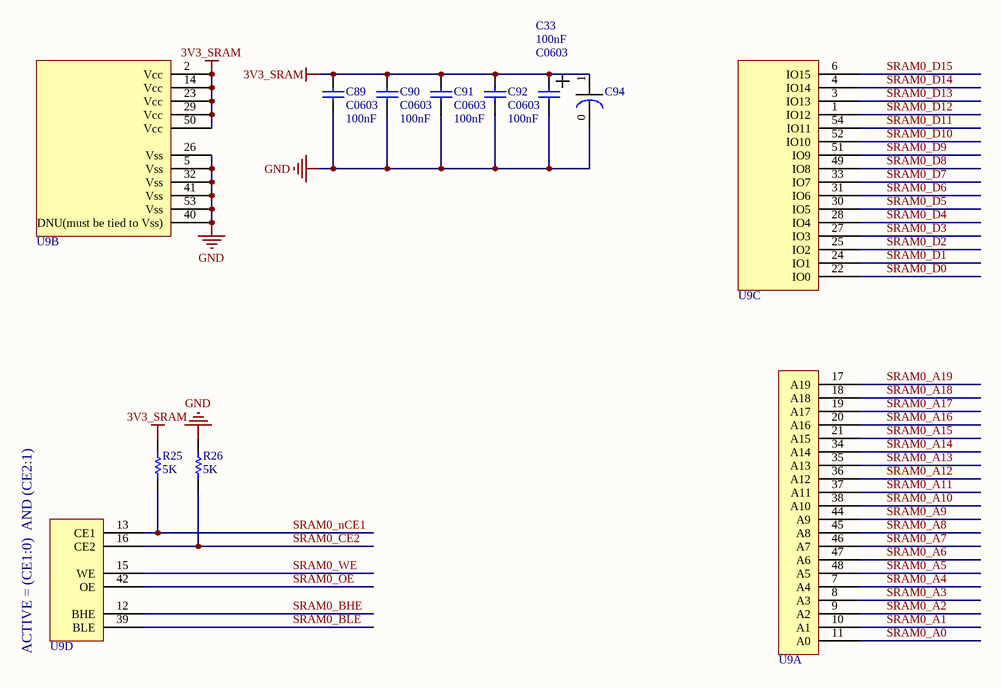
[diagram p8: SRAM.SchDoc]

### Parts
C33  C0603  value 100nF  [0603]
C89  C0603  value 100nF  [0603]
C90  C0603  value 100nF  [0603]
C91  C0603  value 100nF  [0603]
C92  C0603  value 100nF  [0603]
C94  Electrolytic SMD Cap  [22_47u_10A]  (value not drawn)
R25  5K  [ERA-0805]
R26  5K  [ERA-0805]
U9  SRAM  [PCBComponent_1]  (value not drawn)  (parts A,B,C,D of 4)

### Nets
3V3_SRAM: C33.2 C89.2 C90.2 C91.2 C92.2 C94.1 R25.2 U9.2(Vcc) U9.14(Vcc) U9.23(Vcc) U9.29(Vcc) U9.50(Vcc)
GND: C33.1 C89.1 C90.1 C91.1 C92.1 C94.0 R26.2 U9.5(Vss) U9.26(Vss) U9.32(Vss) U9.40(DNU(must_be_tied_to_Vss)) U9.41(Vss) U9.53(Vss)
SRAM0_A0: U9.11(A0)
SRAM0_A1: U9.10(A1)
SRAM0_A2: U9.9(A2)
SRAM0_A3: U9.8(A3)
SRAM0_A4: U9.7(A4)
SRAM0_A5: U9.48(A5)
SRAM0_A6: U9.47(A6)
SRAM0_A7: U9.46(A7)
SRAM0_A8: U9.45(A8)
SRAM0_A9: U9.44(A9)
SRAM0_A10: U9.38(A10)
SRAM0_A11: U9.37(A11)
SRAM0_A12: U9.36(A12)
SRAM0_A13: U9.35(A13)
SRAM0_A14: U9.34(A14)
SRAM0_A15: U9.21(A15)
SRAM0_A16: U9.20(A16)
SRAM0_A17: U9.19(A17)
SRAM0_A18: U9.18(A18)
SRAM0_A19: U9.17(A19)
SRAM0_BHE: U9.12(BHE)
SRAM0_BLE: U9.39(BLE)
SRAM0_CE2: R26.1 U9.16(CE2)
SRAM0_D0: U9.22(IO0)
SRAM0_D1: U9.24(IO1)
SRAM0_D2: U9.25(IO2)
SRAM0_D3: U9.27(IO3)
SRAM0_D4: U9.28(IO4)
SRAM0_D5: U9.30(IO5)
SRAM0_D6: U9.31(IO6)
SRAM0_D7: U9.33(IO7)
SRAM0_D8: U9.49(IO8)
SRAM0_D9: U9.51(IO9)
SRAM0_D10: U9.52(IO10)
SRAM0_D11: U9.54(IO11)
SRAM0_D12: U9.1(IO12)
SRAM0_D13: U9.3(IO13)
SRAM0_D14: U9.4(IO14)
SRAM0_D15: U9.6(IO15)
SRAM0_nCE1: R25.1 U9.13(CE1)
SRAM0_OE: U9.42(OE)
SRAM0_WE: U9.15(WE)

### Notes on the sheet
- ACTIVE = (CE1:0)  AND (CE2:1)
- Engineer:
- Title:
- Saleh Jamali
- Revision:

### Library data of the parts
C33 C89-C92 = C0603: as C1 on sheet FPGA1; Published: 17-Jul-2002; LatestRevisionDate: 19-Mar-2004; LatestRevisionNote: Silkscreen size reduced.; DatasheetDocument: Mar-2001; PackageDocument: Mar-2001; PackageReference: 0603; Publisher: Altium Limited; Code_JEITA: 0603; Code_IPC: 1608 [0603]; ComponentLink1Description: Manufacturer Link; ComponentLink1URL: http://www.kemet.com/; ComponentLink2Description: Datasheet; ComponentLink2URL: http://www.kemet.com/kemet/web/homepage/kechome.nsf/vapubfilesname/F3102TA.pdf/$file/F3102TA.pdf
R25 R26 = ERA6Y: as R20 on sheet PWR2; Published: 17-Dec-2003; LatestRevisionDate: 19-Mar-2004; LatestRevisionNote: Silkscreen size reduced.; PackageDocument: Mar-2003; PackageReference: ERA-0805; Publisher: Altium Limited; Code_IPC: 2012 [0805]; ComponentLink1Description: Manufacturer Link; ComponentLink1URL: http://www.panasonic.com/industrial/components/resistive_products.htm; ComponentLink2Description: Datasheet; ComponentLink2URL: http://www.panasonic.com/industrial/components/pdf/AOA0000CE8.pdf
U9 = CY7C1061AV33: Static RAM
C94 = Electrolytic SMD Cap: supplier: eshop.eca.ir

## Sheet SRAM1.SchDoc: SRAM1
size A; Revision: 04
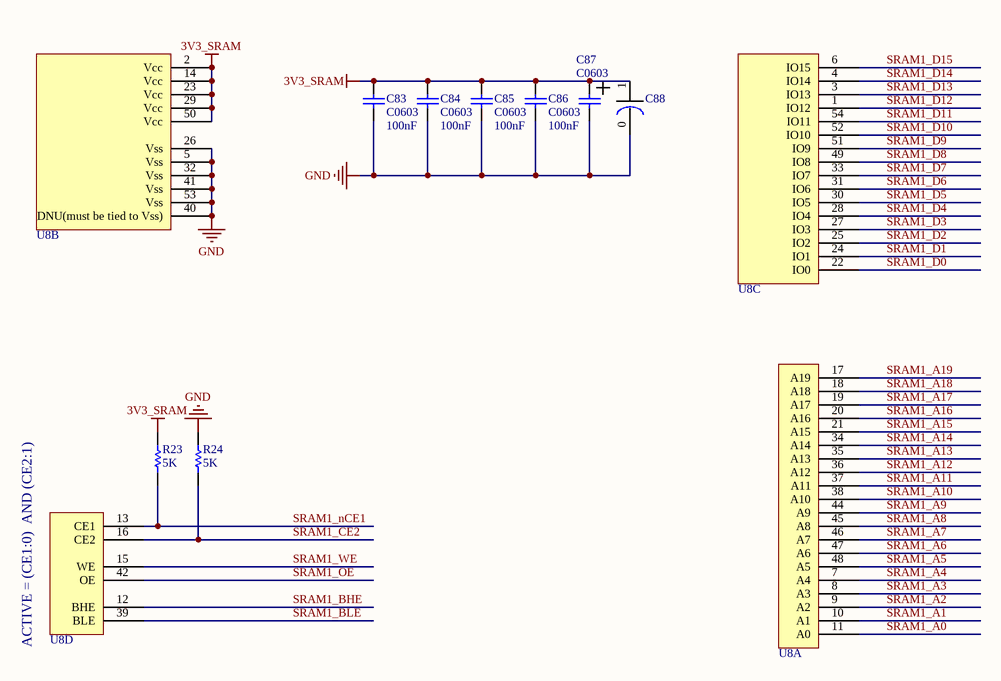
[diagram p9: SRAM1.SchDoc]

### Parts
C83  C0603  value 100nF  [0603]
C84  C0603  value 100nF  [0603]
C85  C0603  value 100nF  [0603]
C86  C0603  value 100nF  [0603]
C87  C0603  [0603]
C88  Electrolytic SMD Cap  [22_47u_10A]  (value not drawn)
R23  5K  [ERA-0805]
R24  5K  [ERA-0805]
U8  SRAM  [PCBComponent_1]  (value not drawn)  (parts A,B,C,D of 4)

### Nets
3V3_SRAM: C83.2 C84.2 C85.2 C86.2 C87.2 C88.1 R23.2 U8.2(Vcc) U8.14(Vcc) U8.23(Vcc) U8.29(Vcc) U8.50(Vcc)
GND: C83.1 C84.1 C85.1 C86.1 C87.1 C88.0 R24.2 U8.5(Vss) U8.26(Vss) U8.32(Vss) U8.40(DNU(must_be_tied_to_Vss)) U8.41(Vss) U8.53(Vss)
SRAM1_A0: U8.11(A0)
SRAM1_A1: U8.10(A1)
SRAM1_A2: U8.9(A2)
SRAM1_A3: U8.8(A3)
SRAM1_A4: U8.7(A4)
SRAM1_A5: U8.48(A5)
SRAM1_A6: U8.47(A6)
SRAM1_A7: U8.46(A7)
SRAM1_A8: U8.45(A8)
SRAM1_A9: U8.44(A9)
SRAM1_A10: U8.38(A10)
SRAM1_A11: U8.37(A11)
SRAM1_A12: U8.36(A12)
SRAM1_A13: U8.35(A13)
SRAM1_A14: U8.34(A14)
SRAM1_A15: U8.21(A15)
SRAM1_A16: U8.20(A16)
SRAM1_A17: U8.19(A17)
SRAM1_A18: U8.18(A18)
SRAM1_A19: U8.17(A19)
SRAM1_BHE: U8.12(BHE)
SRAM1_BLE: U8.39(BLE)
SRAM1_CE2: R24.1 U8.16(CE2)
SRAM1_D0: U8.22(IO0)
SRAM1_D1: U8.24(IO1)
SRAM1_D2: U8.25(IO2)
SRAM1_D3: U8.27(IO3)
SRAM1_D4: U8.28(IO4)
SRAM1_D5: U8.30(IO5)
SRAM1_D6: U8.31(IO6)
SRAM1_D7: U8.33(IO7)
SRAM1_D8: U8.49(IO8)
SRAM1_D9: U8.51(IO9)
SRAM1_D10: U8.52(IO10)
SRAM1_D11: U8.54(IO11)
SRAM1_D12: U8.1(IO12)
SRAM1_D13: U8.3(IO13)
SRAM1_D14: U8.4(IO14)
SRAM1_D15: U8.6(IO15)
SRAM1_nCE1: R23.1 U8.13(CE1)
SRAM1_OE: U8.42(OE)
SRAM1_WE: U8.15(WE)

### Notes on the sheet
- ACTIVE = (CE1:0)  AND (CE2:1)
- Engineer:
- Title:
- Saleh Jamali
- Revision:

### Library data of the parts
C83-C87 = C0603: as C1 on sheet FPGA1; Published: 17-Jul-2002; LatestRevisionDate: 19-Mar-2004; LatestRevisionNote: Silkscreen size reduced.; DatasheetDocument: Mar-2001; PackageDocument: Mar-2001; PackageReference: 0603; Publisher: Altium Limited; Code_JEITA: 0603; Code_IPC: 1608 [0603]; ComponentLink1Description: Manufacturer Link; ComponentLink1URL: http://www.kemet.com/; ComponentLink2Description: Datasheet; ComponentLink2URL: http://www.kemet.com/kemet/web/homepage/kechome.nsf/vapubfilesname/F3102TA.pdf/$file/F3102TA.pdf
R23 R24 = ERA6Y: as R20 on sheet PWR2; Published: 17-Dec-2003; LatestRevisionDate: 19-Mar-2004; LatestRevisionNote: Silkscreen size reduced.; PackageDocument: Mar-2003; PackageReference: ERA-0805; Publisher: Altium Limited; Code_IPC: 2012 [0805]; ComponentLink1Description: Manufacturer Link; ComponentLink1URL: http://www.panasonic.com/industrial/components/resistive_products.htm; ComponentLink2Description: Datasheet; ComponentLink2URL: http://www.panasonic.com/industrial/components/pdf/AOA0000CE8.pdf
U8 = CY7C1061AV33: Static RAM
C88 = Electrolytic SMD Cap: supplier: eshop.eca.ir

## Sheet USBFX2LP_1.SchDoc: USBFX-1
size A; Revision: 04
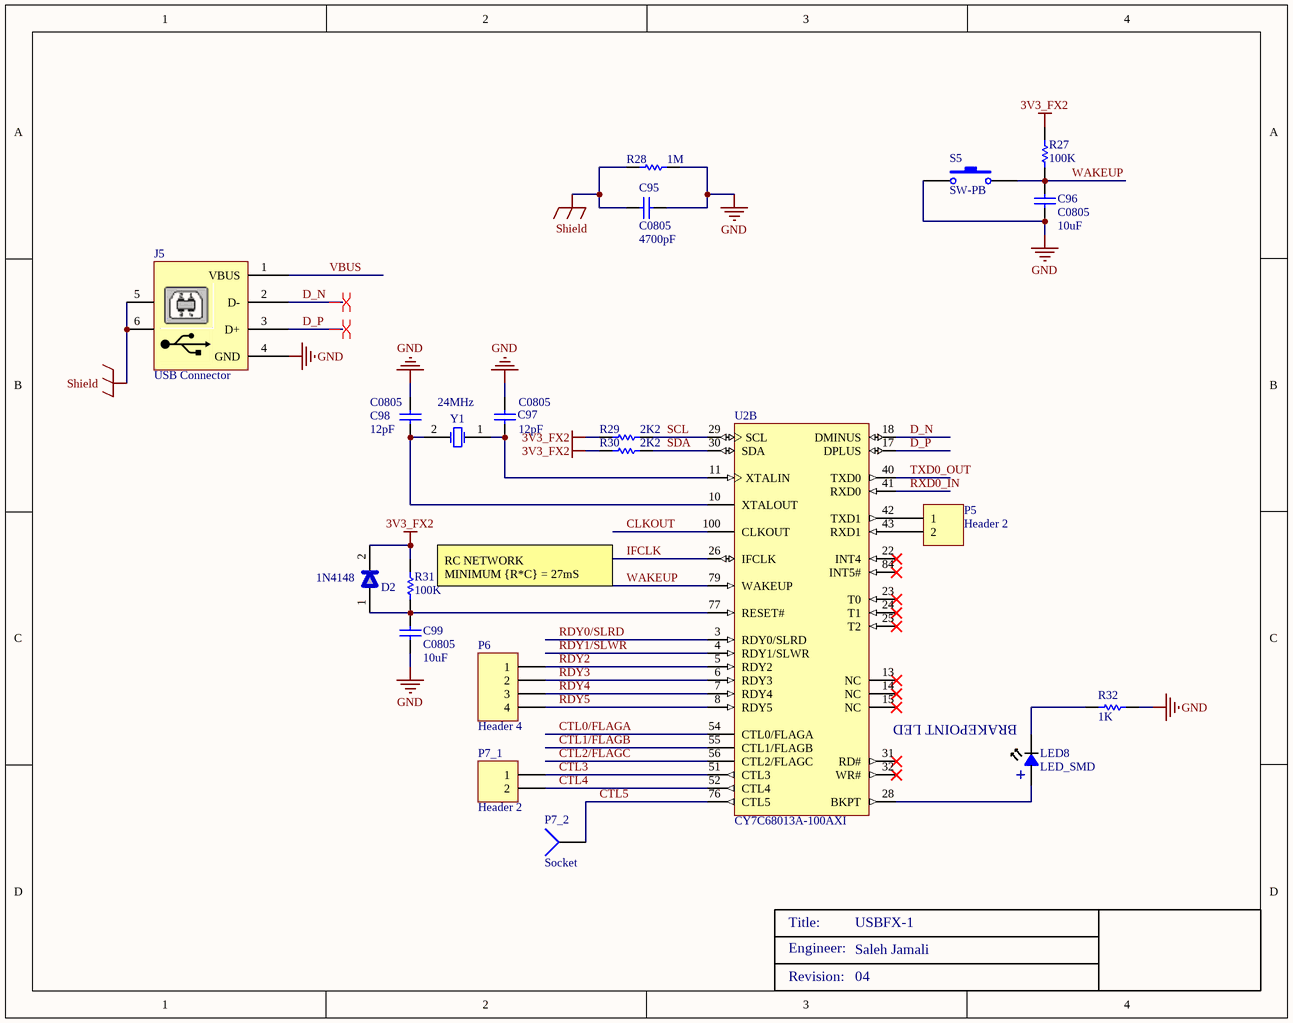
[diagram p10: USBFX2LP_1.SchDoc]

### Parts
C95  C0805  value 4700pF  [0805]
C96  C0805  value 10uF  [0805]
C97  C0805  value 12pF  [0805]
C98  C0805  value 12pF  [0805]
C99  C0805  value 10uF  [0805]
D2  1N4148  [MELF35]
J5  USB Connector  [USB2.5-2H4E]
LED8  LED_SMD  [LED_805]
P5  Header 2  [HDR1X2]
P6  Header 4  [HDR1X4]
P7_1  Header 2  [HDR1X2]
P7_2  Socket  [PIN1]
R27  100K  [ERA-0805]
R28  1M  [ERA-0805]
R29  2K2  [ERA-0805]
R30  2K2  [ERA-0805]
R31  100K  [ERA-0805]
R32  1K  [ERA-0805]
S5  SW-PB  [SPST-2]
U2  CY7C68013A-100AXI  [CYP-AX100RA_N]  (part B of 3)
Y1  24MHz  [HC-49U]

### Nets
3V3_FX2: D2.2 R27.1 R29.2 R30.2 R31.1
GND: C95.2 C96.1 C97.1 C98.1 C99.1 J5.4(GND) R28.1 R32.2 S5.1
Shield: C95.1 J5.5 J5.6 R28.2
CLKOUT: U2.100(CLKOUT)
CTL0/FLAGA: U2.54(CTL0/FLAGA)
CTL1/FLAGB: U2.55(CTL1/FLAGB)
CTL2/FLAGC: U2.56(CTL2/FLAGC)
CTL3: P7_1.1 U2.51(CTL3)
CTL4: P7_1.2 U2.52(CTL4)
CTL5: P7_2.1 U2.76(CTL5)
D_N: J5.2(D-) U2.18(DMINUS)
D_P: J5.3(D+) U2.17(DPLUS)
IFCLK: U2.26(IFCLK)
RDY0/SLRD: U2.3(RDY0/SLRD)
RDY1/SLWR: U2.4(RDY1/SLWR)
RDY2: P6.1 U2.5(RDY2)
RDY3: P6.2 U2.6(RDY3)
RDY4: P6.3 U2.7(RDY4)
RDY5: P6.4 U2.8(RDY5)
RXD0_IN: U2.41(RXD0)
SCL: R29.1 U2.29(SCL)
SDA: R30.1 U2.30(SDA)
TXD0_OUT: U2.40(TXD0)
VBUS: J5.1(VBUS)
WAKEUP: C96.2 R27.2 S5.2 U2.79(WAKEUP)
NetC97_2: C97.2 U2.11(XTALIN) Y1.1(OSC1)
NetC98_2: C98.2 U2.10(XTALOUT) Y1.2(OSC2)
NetC99_2: C99.2 D2.1 R31.2 U2.77(RESET#)
NetLED8_1: LED8.1 U2.28(BKPT)
NetLED8_2: LED8.2 R32.1
NetP5_1: P5.1 U2.42(TXD1)
NetP5_2: P5.2 U2.43(RXD1)

Not connected (* = marked no-connect by the designer): U2 13(NC)* 14(NC)* 15(NC)* 22(INT4)* 23(T0)* 24(T1)* 25(T2)* 31(RD#)* 32(WR#)* 84(INT5#)*

### Layout directives
differential pair: D_N, D_P

### Notes on the sheet
- (near R31) RC NETWORK
  MINIMUM {R*C} = 27mS
- (near LED8) BRAKEPOINT LED
- Engineer:
- Title:
- Saleh Jamali
- Revision:

### Library data of the parts
C95-C99 = C0805: as C75 on sheet PWR2; Published: 17-Jul-2002; LatestRevisionDate: 19-Mar-2004; LatestRevisionNote: Silkscreen size reduced.; DatasheetDocument: Mar-2001; PackageDocument: Mar-2001; PackageReference: 0805; Publisher: Altium Limited; Code_JEITA: 0805; Code_IPC: 2012[0805]; ComponentLink1Description: Manufacturer Link; ComponentLink1URL: http://www.kemet.com/; ComponentLink2Description: Datasheet; ComponentLink2URL: http://www.kemet.com/kemet/web/homepage/kechome.nsf/vapubfilesname/F3102TA.pdf/$file/F3102TA.pdf
D2 = Diode_SMD: melf 35 general purpose diode
J5 = USB: USB Connector-B Type; Designer: Eng. Saeid Jorablo; Company: DASE Co; Adding Date: 10/26/2010
P5 P7_1 = Header 2: Header, 2-Pin; LatestRevisionDate: 17-Jul-2002; LatestRevisionNote: Re-released for DXP Platform.; Publisher: Altium Limited
P6 = Header 4: Header, 4-Pin; LatestRevisionDate: 17-Jul-2002; LatestRevisionNote: Re-released for DXP Platform.; Publisher: Altium Limited
R27-R32 = ERA6Y: as R20 on sheet PWR2; Published: 17-Dec-2003; LatestRevisionDate: 19-Mar-2004; LatestRevisionNote: Silkscreen size reduced.; PackageDocument: Mar-2003; PackageReference: ERA-0805; Publisher: Altium Limited; Code_IPC: 2012 [0805]; ComponentLink1Description: Manufacturer Link; ComponentLink1URL: http://www.panasonic.com/industrial/components/resistive_products.htm; ComponentLink2Description: Datasheet; ComponentLink2URL: http://www.panasonic.com/industrial/components/pdf/AOA0000CE8.pdf
S5 = SW-PB: Switch; Published: 24-Mar-1999; LatestRevisionDate: 17-Jul-2002; LatestRevisionNote: Re-released for DXP Platform.; PackageReference: SPST-2; Publisher: Altium Limited; PackageDescription: Switch; 2 Leads
U2 = CY7C68013A-100AXI: EZ-USB(R) FX2LP(TM) USB Microcontroller High-Speed USB Peripheral Controller, 16 KB, 40 I/Os, 3 to 3.6 V, -40 to 85 degC, 100-Pin TQFP (AX100RA), Tray; Manufacturer: Cypress; Max. Operating Voltage (V): 3.6; Memory Architecture: RAM; Memory Size (KB): 16; Min. Operating Voltage (V): 3; No. of I/Os: 40; DatasheetVersion: Rev. *W; PackageVersion: Rev. *E; PackageReference: AX100RA; PackageDescription: 100-Pin Thin Quad Flat Pack, Body 14 x 20 mm, Pitch 0.65 mm; Supplier 1: Digi-Key; Supplier Part Number 1: 428-2263-ND; Supplier 2: Farnell; Supplier Part Number 2: 1876347; Supplier 3: Newark; Supplier Part Number 3: 19M7107; Supplier 4: Mouser; Supplier Part Number 4: 727-CYC68013A100AXI; CPU Core: Enhanced 8051; Max. Operating Temp. (degreesC): 85; Min. Operating Temp. (degreesC): -40; Packing: Tray; RoHS: Pb-Free; Mounting Technology: Surface Mount; Code_JEDEC: MS-026; PartNumber: CY7C68013A-100AXI; ComponentLink1Description: Manufacturer URL; ComponentLink1URL: http://www.cypress.com/; ComponentLink2Description: Datasheet; ComponentLink2URL: http://www.cypress.com/?docID=45142; ComponentLink3Description: Package Specification; ComponentLink3URL: http://www.cypress.com/?docID=48215
Y1 = ECS-10-13-1: Crystal Oscillator; Published: 17-Jul-2002; DatasheetDocument: 18-Apr-2000; PackageReference: HC-49U; Publisher: Altium Limited; ComponentLink1Description: Manufacturer Link; ComponentLink1URL: http://www.ecsxtal.com/; ComponentLink2Description: Datasheet; ComponentLink2URL: http://www.ecsxtal.com/pdf2/HC49U.PDF
P7_2 = Socket: LatestRevisionDate: 17-Jul-2002; LatestRevisionNote: Re-released for DXP Platform.; Publisher: Altium Limited

## Sheet USBFX2LP_2.SchDoc: USBFX-2
size A; Revision: 04
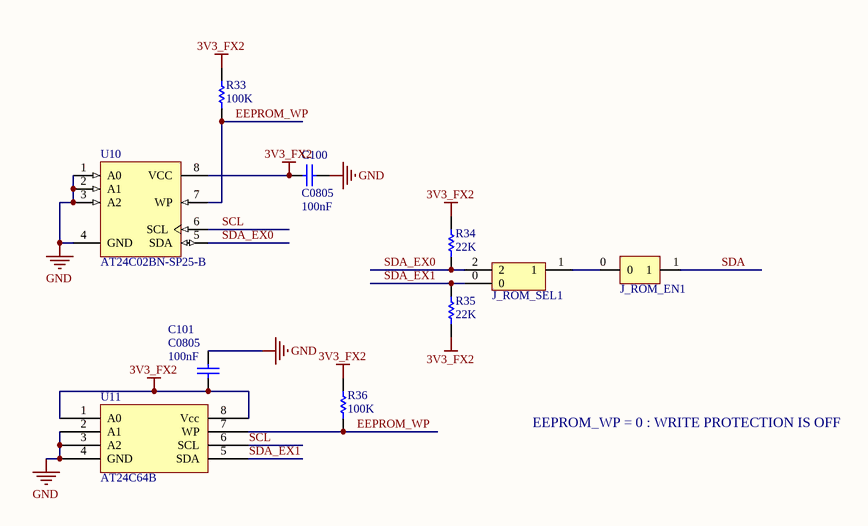
[diagram p11: USBFX2LP_2.SchDoc]

### Parts
C100  C0805  value 100nF  [0805]
C101  C0805  value 100nF  [0805]
J_ROM_EN1  2pin  [2PIN]  (value not drawn)
J_ROM_SEL1  3pin  [3PIN]  (value not drawn)
R33  100K  [ERA-0805]
R34  22K  [ERA-0805]
R35  22K  [ERA-0805]
R36  100K  [ERA-0805]
U10  AT24C02BN-SP25-B  [8S1_N]
U11  AT24C64B  [AT24C512B]

### Nets
3V3_FX2: C100.2 C101.1 R33.1 R34.1 R35.1 R36.1 U10.8(VCC) U11.1(A0) U11.8(Vcc)
GND: C100.1 C101.2 U10.1(A0) U10.2(A1) U10.3(A2) U10.4(GND) U11.2(A1) U11.3(A2) U11.4(GND)
EEPROM_WP: R33.2 R36.2 U10.7(WP) U11.7(WP)
SCL: U10.6(SCL) U11.6(SCL)
SDA: J_ROM_EN1.1
SDA_EX0: J_ROM_SEL1.2 R34.2 U10.5(SDA)
SDA_EX1: J_ROM_SEL1.0 R35.2 U11.5(SDA)
NetJ_ROM_EN1_0: J_ROM_EN1.0 J_ROM_SEL1.1

### Notes on the sheet
- EEPROM_WP = 0 : WRITE PROTECTION IS OFF
- Engineer:
- Title:
- Saleh Jamali
- Revision:

### Library data of the parts
C100 C101 = C0805: as C75 on sheet PWR2; Published: 17-Jul-2002; LatestRevisionDate: 19-Mar-2004; LatestRevisionNote: Silkscreen size reduced.; DatasheetDocument: Mar-2001; PackageDocument: Mar-2001; PackageReference: 0805; Publisher: Altium Limited; Code_JEITA: 0805; Code_IPC: 2012[0805]; ComponentLink1Description: Manufacturer Link; ComponentLink1URL: http://www.kemet.com/; ComponentLink2Description: Datasheet; ComponentLink2URL: http://www.kemet.com/kemet/web/homepage/kechome.nsf/vapubfilesname/F3102TA.pdf/$file/F3102TA.pdf
R33-R36 = ERA6Y: as R20 on sheet PWR2; Published: 17-Dec-2003; LatestRevisionDate: 19-Mar-2004; LatestRevisionNote: Silkscreen size reduced.; PackageDocument: Mar-2003; PackageReference: ERA-0805; Publisher: Altium Limited; Code_IPC: 2012 [0805]; ComponentLink1Description: Manufacturer Link; ComponentLink1URL: http://www.panasonic.com/industrial/components/resistive_products.htm; ComponentLink2Description: Datasheet; ComponentLink2URL: http://www.panasonic.com/industrial/components/pdf/AOA0000CE8.pdf
U10 = AT24C02BN-SP25-B: 2Kbit (256 x 8), 2-wire Bus Automotive Serial EEPROM with full memory Write Protect, 2.5V, 8-Pin SOIC, Bulk; DatasheetVersion: 8517C,  Jan-2009; PackageVersion: revC, Mar-2005; PackageReference: 8S1; PackageDescription: 8-Lead (0.150" Wide Body), Plastic Gull Wing Small Outline (JEDEC SOIC); Code_JEDEC: MS-012-AA; Code_IPC: SOIC127P600-8; ComponentLink1Description: Manufacturer URL; ComponentLink1URL: http://www.atmel.com/; ComponentLink2Description: Datasheet; ComponentLink2URL: http://www.atmel.com/dyn/resources/prod_documents/doc8517.pdf
U11 = AT24C512B SOIC8 PITCH 1.27

## Sheet USBFX2LP_3.SchDoc: USBFX-3
size A; Revision: 04
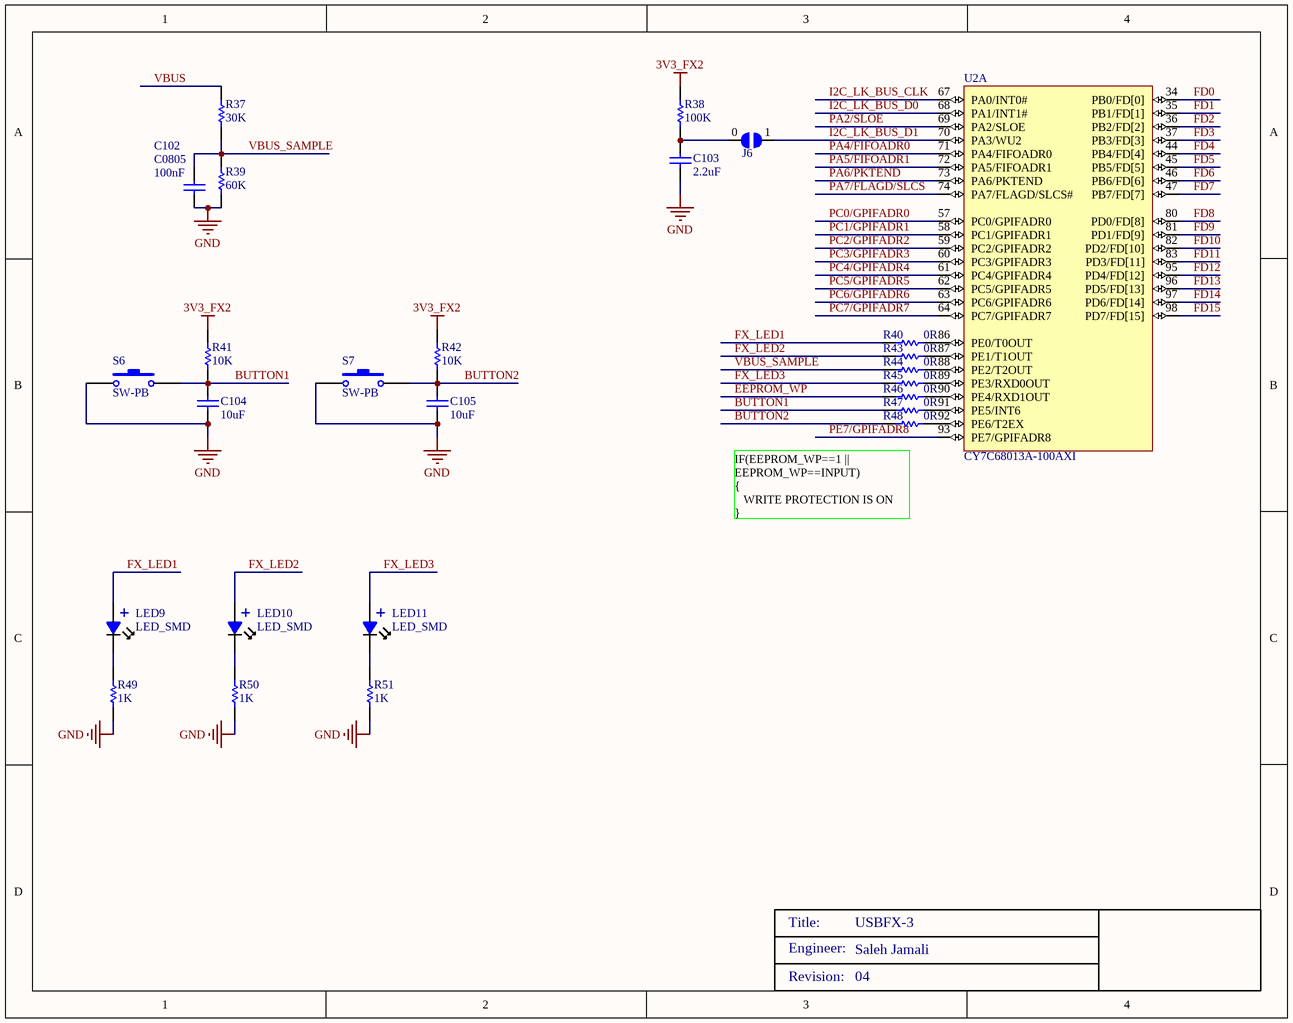
[diagram p12: USBFX2LP_3.SchDoc]

### Parts
C102  C0805  value 100nF  [0805]
C103  value 2.2uF  [0805]  (hidden comment: C0805)
C104  value 10uF  [0805]  (hidden comment: C0805)
C105  value 10uF  [0805]  (hidden comment: C0805)
J6  jumper  [jumper_pcb]  (value not drawn)
LED9  LED_SMD  [LED_805]
LED10  LED_SMD  [LED_805]
LED11  LED_SMD  [LED_805]
R37  30K  [ERA-0805]
R38  100K  [ERA-0805]
R39  60K  [ERA-0805]
R40  0R  [ERA-0805]
R41  10K  [ERA-0805]
R42  10K  [ERA-0805]
R43  0R  [ERA-0805]
R44  0R  [ERA-0805]
R45  0R  [ERA-0805]
R46  0R  [ERA-0805]
R47  0R  [ERA-0805]
R48  0R  [ERA-0805]
R49  1K  [ERA-0805]
R50  1K  [ERA-0805]
R51  1K  [ERA-0805]
S6  SW-PB  [SPST-2]
S7  SW-PB  [SPST-2]
U2  CY7C68013A-100AXI  [CYP-AX100RA_N]  (part A of 3)

### Nets
3V3_FX2: R38.1 R41.1 R42.1
GND: C102.1 C103.1 C104.1 C105.1 R39.2 R49.1 R50.1 R51.1 S6.1 S7.1
BUTTON1: C104.2 R41.2 R47.1 S6.2
BUTTON2: C105.2 R42.2 R48.1 S7.2
EEPROM_WP: R46.1
FD0: U2.34(PB0/FD[0])
FD1: U2.35(PB1/FD[1])
FD2: U2.36(PB2/FD[2])
FD3: U2.37(PB3/FD[3])
FD4: U2.44(PB4/FD[4])
FD5: U2.45(PB5/FD[5])
FD6: U2.46(PB6/FD[6])
FD7: U2.47(PB7/FD[7])
FD8: U2.80(PD0/FD[8])
FD9: U2.81(PD1/FD[9])
FD10: U2.82(PD2/FD[10])
FD11: U2.83(PD3/FD[11])
FD12: U2.95(PD4/FD[12])
FD13: U2.96(PD5/FD[13])
FD14: U2.97(PD6/FD[14])
FD15: U2.98(PD7/FD[15])
FX_LED1: LED9.1 R40.1
FX_LED2: LED10.1 R43.1
FX_LED3: LED11.1 R45.1
I2C_LK_BUS_CLK: U2.67(PA0/INT0#)
I2C_LK_BUS_D0: U2.68(PA1/INT1#)
I2C_LK_BUS_D1: J6.1 U2.70(PA3/WU2)
PA2/SLOE: U2.69(PA2/SLOE)
PA4/FIFOADR0: U2.71(PA4/FIFOADR0)
PA5/FIFOADR1: U2.72(PA5/FIFOADR1)
PA6/PKTEND: U2.73(PA6/PKTEND)
PA7/FLAGD/SLCS: U2.74(PA7/FLAGD/SLCS#)
PC0/GPIFADR0: U2.57(PC0/GPIFADR0)
PC1/GPIFADR1: U2.58(PC1/GPIFADR1)
PC2/GPIFADR2: U2.59(PC2/GPIFADR2)
PC3/GPIFADR3: U2.60(PC3/GPIFADR3)
PC4/GPIFADR4: U2.61(PC4/GPIFADR4)
PC5/GPIFADR5: U2.62(PC5/GPIFADR5)
PC6/GPIFADR6: U2.63(PC6/GPIFADR6)
PC7/GPIFADR7: U2.64(PC7/GPIFADR7)
PE7/GPIFADR8: U2.93(PE7/GPIFADR8)
VBUS: R37.1
VBUS_SAMPLE: C102.2 R37.2 R39.1 R44.1
NetC103_2: C103.2 J6.0 R38.2
NetLED9_2: LED9.2 R49.2
NetLED10_2: LED10.2 R50.2
NetLED11_2: LED11.2 R51.2
NetR40_2: R40.2 U2.86(PE0/T0OUT)
NetR43_2: R43.2 U2.87(PE1/T1OUT)
NetR44_2: R44.2 U2.88(PE2/T2OUT)
NetR45_2: R45.2 U2.89(PE3/RXD0OUT)
NetR46_2: R46.2 U2.90(PE4/RXD1OUT)
NetR47_2: R47.2 U2.91(PE5/INT6)
NetR48_2: R48.2 U2.92(PE6/T2EX)

### Notes on the sheet
- IF(EEPROM_WP==1 || EEPROM_WP==INPUT)
  {
  WRITE PROTECTION IS ON
  }
- Engineer:
- Title:
- Saleh Jamali
- Revision:

### Library data of the parts
C102-C105 = C0805: as C75 on sheet PWR2; Published: 17-Jul-2002; LatestRevisionDate: 19-Mar-2004; LatestRevisionNote: Silkscreen size reduced.; DatasheetDocument: Mar-2001; PackageDocument: Mar-2001; PackageReference: 0805; Publisher: Altium Limited; Code_JEITA: 0805; Code_IPC: 2012[0805]; ComponentLink1Description: Manufacturer Link; ComponentLink1URL: http://www.kemet.com/; ComponentLink2Description: Datasheet; ComponentLink2URL: http://www.kemet.com/kemet/web/homepage/kechome.nsf/vapubfilesname/F3102TA.pdf/$file/F3102TA.pdf
R37-R51 = ERA6Y: as R20 on sheet PWR2; Published: 17-Dec-2003; LatestRevisionDate: 19-Mar-2004; LatestRevisionNote: Silkscreen size reduced.; PackageDocument: Mar-2003; PackageReference: ERA-0805; Publisher: Altium Limited; Code_IPC: 2012 [0805]; ComponentLink1Description: Manufacturer Link; ComponentLink1URL: http://www.panasonic.com/industrial/components/resistive_products.htm; ComponentLink2Description: Datasheet; ComponentLink2URL: http://www.panasonic.com/industrial/components/pdf/AOA0000CE8.pdf
S6 S7 = SW-PB: Switch; Published: 24-Mar-1999; LatestRevisionDate: 17-Jul-2002; LatestRevisionNote: Re-released for DXP Platform.; PackageReference: SPST-2; Publisher: Altium Limited; PackageDescription: Switch; 2 Leads
U2 = CY7C68013A-100AXI: as U2 on sheet USBFX2LP_1; DatasheetVersion: Rev. *W; PackageVersion: Rev. *E; PackageReference: AX100RA; PackageDescription: 100-Pin Thin Quad Flat Pack, Body 14 x 20 mm, Pitch 0.65 mm; Supplier 1: Digi-Key; Supplier Part Number 1: 428-2263-ND; Supplier 2: Farnell; Supplier Part Number 2: 1876347; Supplier 3: Newark; Supplier Part Number 3: 19M7107; Supplier 4: Mouser; Supplier Part Number 4: 727-CYC68013A100AXI; CPU Core: Enhanced 8051; Max. Operating Temp. (degreesC): 85; Min. Operating Temp. (degreesC): -40; Packing: Tray; RoHS: Pb-Free; Mounting Technology: Surface Mount; Code_JEDEC: MS-026; PartNumber: CY7C68013A-100AXI; ComponentLink1Description: Manufacturer URL; ComponentLink1URL: http://www.cypress.com/; ComponentLink2Description: Datasheet; ComponentLink2URL: http://www.cypress.com/?docID=45142; ComponentLink3Description: Package Specification; ComponentLink3URL: http://www.cypress.com/?docID=48215

## Sheet USBFX2LP_4.SchDoc: USBFX-4
size A; Revision: 04
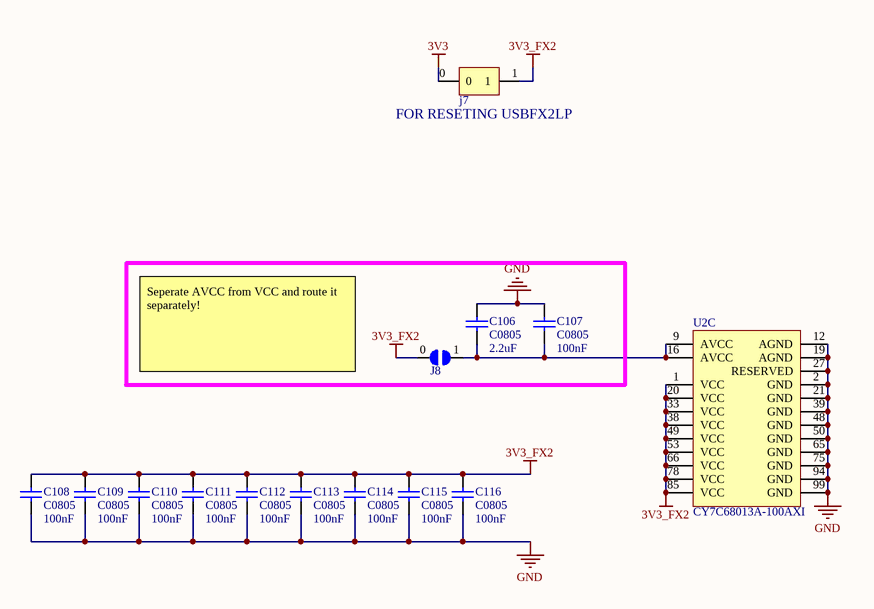
[diagram p13: USBFX2LP_4.SchDoc]

### Parts
C106  C0805  value 2.2uF  [0805]
C107  C0805  value 100nF  [0805]
C108  C0805  value 100nF  [0805]
C109  C0805  value 100nF  [0805]
C110  C0805  value 100nF  [0805]
C111  C0805  value 100nF  [0805]
C112  C0805  value 100nF  [0805]
C113  C0805  value 100nF  [0805]
C114  C0805  value 100nF  [0805]
C115  C0805  value 100nF  [0805]
C116  C0805  value 100nF  [0805]
j7  2pin  [2PIN]  (value not drawn)
J8  jumper  [jumper_pcb]  (value not drawn)
U2  CY7C68013A-100AXI  [CYP-AX100RA_N]  (part C of 3)

### Nets
3V3: j7.0
3V3_FX2: C108.2 C109.2 C110.2 C111.2 C112.2 C113.2 C114.2 C115.2 C116.2 j7.1 J8.0 U2.1(VCC) U2.20(VCC) U2.33(VCC) U2.38(VCC) U2.49(VCC) U2.53(VCC) U2.66(VCC) U2.78(VCC) U2.85(VCC)
GND: C106.2 C107.2 C108.1 C109.1 C110.1 C111.1 C112.1 C113.1 C114.1 C115.1 C116.1 U2.2(GND) U2.12(AGND) U2.19(AGND) U2.21(GND) U2.27(RESERVED) U2.39(GND) U2.48(GND) U2.50(GND) U2.65(GND) U2.75(GND) U2.94(GND) U2.99(GND)
NetC106_1: C106.1 C107.1 J8.1 U2.9(AVCC) U2.16(AVCC)

### Notes on the sheet
- (near j7) FOR RESETING USBFX2LP
- Seperate AVCC from VCC and route it separately!
- Engineer:
- Title:
- Saleh Jamali
- Revision:

### Library data of the parts
C106-C116 = C0805: as C75 on sheet PWR2; Published: 17-Jul-2002; LatestRevisionDate: 19-Mar-2004; LatestRevisionNote: Silkscreen size reduced.; DatasheetDocument: Mar-2001; PackageDocument: Mar-2001; PackageReference: 0805; Publisher: Altium Limited; Code_JEITA: 0805; Code_IPC: 2012[0805]; ComponentLink1Description: Manufacturer Link; ComponentLink1URL: http://www.kemet.com/; ComponentLink2Description: Datasheet; ComponentLink2URL: http://www.kemet.com/kemet/web/homepage/kechome.nsf/vapubfilesname/F3102TA.pdf/$file/F3102TA.pdf
U2 = CY7C68013A-100AXI: as U2 on sheet USBFX2LP_1; DatasheetVersion: Rev. *W; PackageVersion: Rev. *E; PackageReference: AX100RA; PackageDescription: 100-Pin Thin Quad Flat Pack, Body 14 x 20 mm, Pitch 0.65 mm; Supplier 1: Digi-Key; Supplier Part Number 1: 428-2263-ND; Supplier 2: Farnell; Supplier Part Number 2: 1876347; Supplier 3: Newark; Supplier Part Number 3: 19M7107; Supplier 4: Mouser; Supplier Part Number 4: 727-CYC68013A100AXI; CPU Core: Enhanced 8051; Max. Operating Temp. (degreesC): 85; Min. Operating Temp. (degreesC): -40; Packing: Tray; RoHS: Pb-Free; Mounting Technology: Surface Mount; Code_JEDEC: MS-026; PartNumber: CY7C68013A-100AXI; ComponentLink1Description: Manufacturer URL; ComponentLink1URL: http://www.cypress.com/; ComponentLink2Description: Datasheet; ComponentLink2URL: http://www.cypress.com/?docID=45142; ComponentLink3Description: Package Specification; ComponentLink3URL: http://www.cypress.com/?docID=48215